# Altium project MOTHERBOARD.PrjPcb
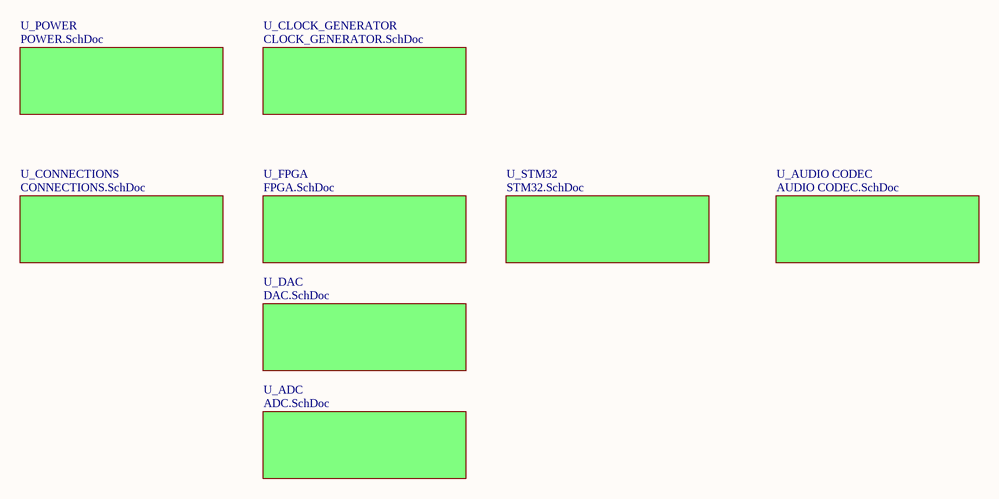
[diagram p0: MOTHERBOARD.SCHDOC]
9 sheets, 287 parts. Net scope: global (net labels, ports and power ports of the same name join across sheets).
Board file: MOTHERBOARD.PcbDoc
Sheets:
  MOTHERBOARD.SCHDOC
    U_ADC = ADC.SchDoc
    U_AUDIO CODEC = AUDIO CODEC.SchDoc
    U_DAC = DAC.SchDoc
    U_FPGA = FPGA.SchDoc
    U_POWER = POWER.SchDoc
    U_STM32 = STM32.SchDoc
    U_CLOCK_GENERATOR = CLOCK_GENERATOR.SchDoc
    U_CONNECTIONS = CONNECTIONS.SchDoc

## Sheet MOTHERBOARD.SCHDOC: MOTHERBOARD
size A4; DocumentNumber: 2; Revision: 2.0; SheetNumber: 2; SheetTotal: 18

### Sub-sheets
U_ADC = ADC.SchDoc: no entries
U_AUDIO CODEC = AUDIO CODEC.SchDoc: no entries
U_CLOCK_GENERATOR = CLOCK_GENERATOR.SchDoc: no entries
U_CONNECTIONS = CONNECTIONS.SchDoc: no entries
U_DAC = DAC.SchDoc: no entries
U_FPGA = FPGA.SchDoc: no entries
U_POWER = POWER.SchDoc: no entries
U_STM32 = STM32.SchDoc: no entries

### Notes on the sheet
- Title
- Size:
- Date:
- A4
- Number:
- Time:
- Revision:
- Sheet
- of
- File:

## Sheet ADC.SchDoc: ADC
size A4; DocumentNumber: 3; Revision: 2.0; SheetNumber: 3; SheetTotal: 18
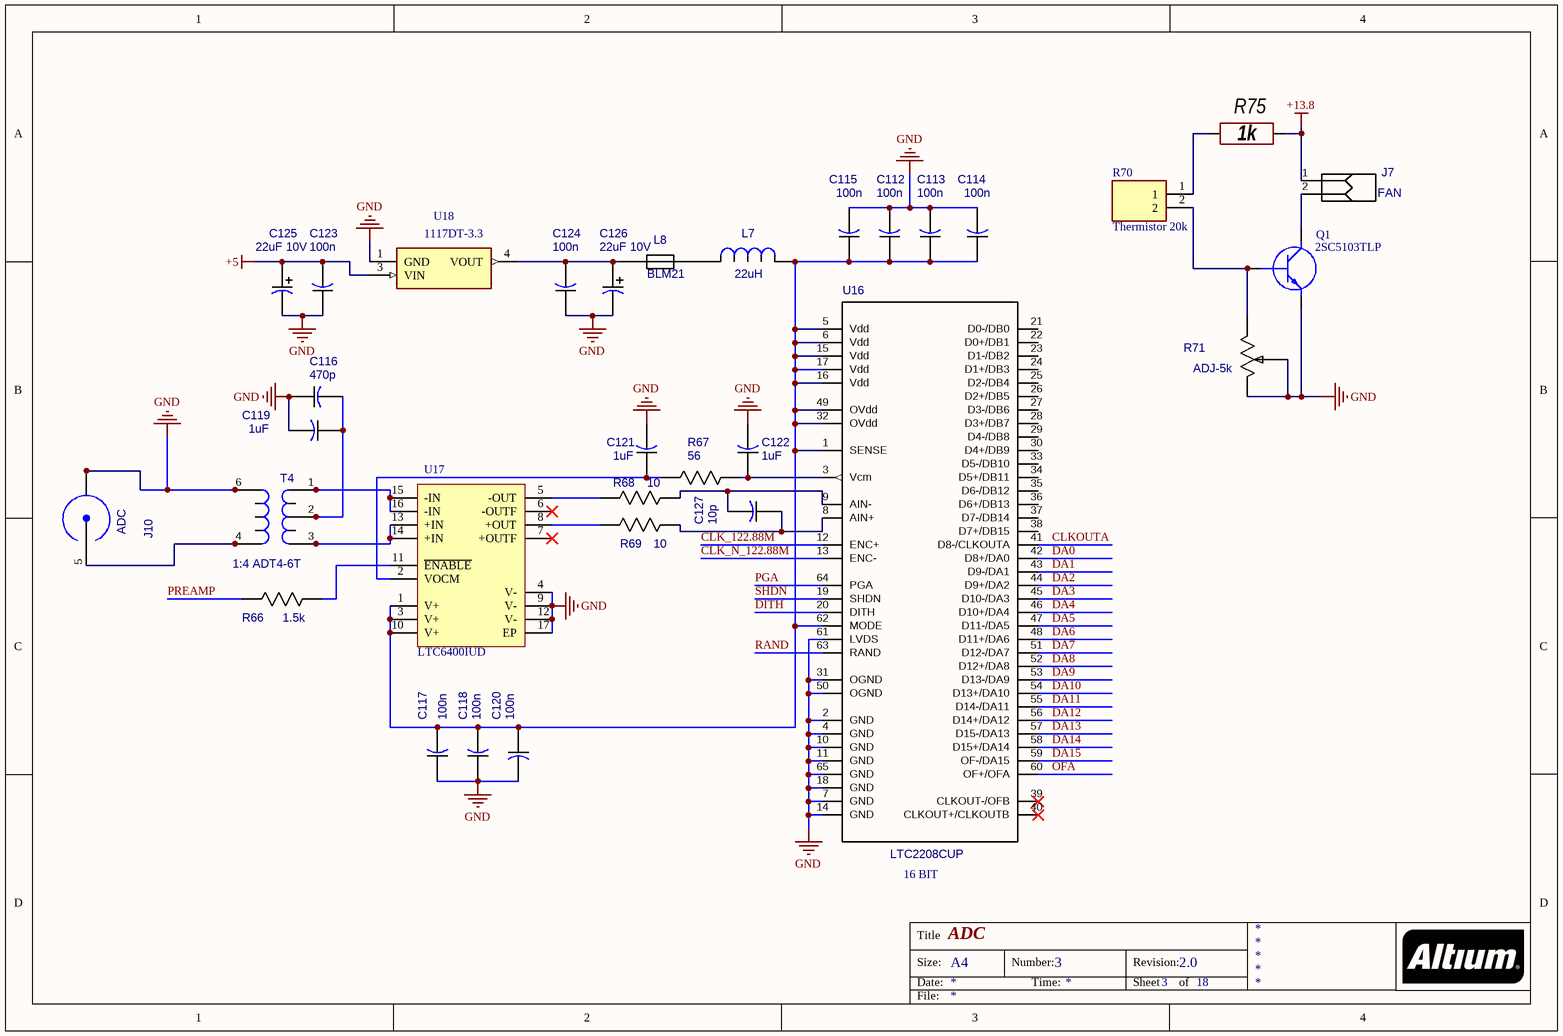
[diagram p1: ADC.SchDoc]

### Parts
C112  100n  [CAP_0805]
C113  100n  [CAP_0805]
C114  100n  [CAP_0805]
C115  100n  [CAP_0805]
C116  470p  [CAP_0805]
C117  100n  [CAP_0805]
C118  100n  [CAP_0805]
C119  1uF  [CAP_0805]
C120  100n  [CAP_0805]
C121  1uF  [CAP_0805]
C122  1uF  [CAP_0805]
C123  100n  [CAP_0805]
C124  100n  [CAP_0805]
C125  22uF 10V  [CAPAE_4.3x4.3h5.4]
C126  22uF 10V  [CAPAE_4.3x4.3h5.4]
C127  10p  [CAP_0805]
J7  FAN  [51022-0200]
J10  ADC  [31-5431]
L7  22uH  [IND_7x7]
L8  BLM21  [CAP_0805]
Q1  2SC5103TLP  [2SC5103TLQ]
R66  1.5k  [RES_0805]
R67  56  [RES_0805]
R68  10  [RES_0603]
R69  10  [RES_0603]
R70  Thermistor 20k  [MF52A103F3950A1]
R71  ADJ-5k  [306J]
R75  1k  [CH0805R]
T4  1:4 ADT4-6T  [TRANSF_ACORE2]
U16  LTC2208CUP  [LTC2208CUP]
U17  LTC6400IUD  [LT-UD-16_N]
U18  1117DT-3.3  [TO228P991X238-3N]

### Nets
+5: C123.2 C125.1(PLUS) U18.3(VIN)
+13.8: J7.1 R75.2
CLK_122.88M: U16.12(ENC+)
CLK_N_122.88M: U16.13(ENC-)
GND: C112.2 C113.2 C114.2 C115.2 C116.1 C117.1 C118.1 C119.2 C120.2 C121.2 C122.2 C123.1 C124.1 C125.2(MINUS) C126.2(MINUS) J10.1(GND) J10.2(GND) J10.3(GND) J10.4(GND) Q1.3(E) R71.1(CCW) R71.2(W) T4.6(P2) T4.10 U16.2(GND) U16.4(GND) U16.7(GND) U16.10(GND) U16.11(GND) U16.14(GND) U16.18(GND) U16.31(OGND) U16.50(OGND) U16.61(LVDS) U16.65(GND) U17.4(V-) U17.9(V-) U17.12(V-) U17.17(EP) U18.1(GND)
CLKOUTA: U16.41(D8-/CLKOUTA)
DA0: U16.42(D8+/DA0)
DA1: U16.43(D9-/DA1)
DA2: U16.44(D9+/DA2)
DA3: U16.45(D10-/DA3)
DA4: U16.46(D10+/DA4)
DA5: U16.47(D11-/DA5)
DA6: U16.48(D11+/DA6)
DA7: U16.51(D12-/DA7)
DA8: U16.52(D12+/DA8)
DA9: U16.53(D13-/DA9)
DA10: U16.54(D13+/DA10)
DA11: U16.55(D14-/DA11)
DA12: U16.56(D14+/DA12)
DA13: U16.57(D15-/DA13)
DA14: U16.58(D15+/DA14)
DA15: U16.59(OF-/DA15)
DITH: U16.20(DITH)
OFA: U16.60(OF+/OFA)
PGA: U16.64(PGA)
PREAMP: R66.2
RAND: U16.63(RAND)
SHDN: U16.19(SHDN)
NetC112_1: C112.1 C113.1 C114.1 C115.1 C117.2 C118.2 C120.1 L7.2 U16.1(SENSE) U16.5(Vdd) U16.6(Vdd) U16.15(Vdd) U16.16(Vdd) U16.17(Vdd) U16.32(OVdd) U16.49(OVdd) U16.62(MODE) U17.1(V+) U17.3(V+) U17.10(V+)
NetC116_2: C116.2 C119.1 T4.2(S2) T4.8
NetC121_1: C121.1 R67.1 U17.2(VOCM)
NetC122_1: C122.1 R67.2 U16.3(Vcm)
NetC124_2: C124.2 C126.1(PLUS) L8.1 U18.4(VOUT)
NetC127_1: C127.1 R69.2 U16.8(AIN+)
NetC127_2: C127.2 R68.2 U16.9(AIN-)
NetJ7_2: J7.2 Q1.2(C)
NetJ10_5: J10.5(CON) T4.4(P1) T4.11
NetL7_1: L7.1 L8.2
NetQ1_1: Q1.1(B) R70.2 R71.3(CW)
NetR66_1: R66.1 U17.11(~{ENABLE})
NetR68_1: R68.1 U17.5(-OUT)
NetR69_1: R69.1 U17.8(+OUT)
NetR70_1: R70.1 R75.1
NetT4_1: T4.1(S3) T4.7 U17.15(-IN) U17.16(-IN)
NetT4_3: T4.3(S1) T4.9 U17.13(+IN) U17.14(+IN)

Not connected (* = marked no-connect by the designer): U16 21(D0-/DB0) 22(D0+/DB1) 23(D1-/DB2) 24(D1+/DB3) 25(D2-/DB4) 26(D2+/DB5) 27(D3-/DB6) 28(D3+/DB7) 29(D4-/DB8) 30(D4+/DB9) 33(D5-/DB10) 34(D5+/DB11) 35(D6-/DB12) 36(D6+/DB13) 37(D7-/DB14) 38(D7+/DB15) 39(CLKOUT-/OFB)* 40(CLKOUT+/CLKOUTB)*; U17 6(-OUTF)* 7(+OUTF)*

### Notes on the sheet
- 16 BIT
- Title
- Size:
- Date:
- A4
- Number:
- Time:
- Revision:
- Sheet
- of
- File:

### Library data of the parts
C112-C124 C127 = CAP_0805
  C112-C115 C117 C118 C120 C123 C124: Value: 100n
  C116: Value: 470p
  C119 C121 C122: Value: 1uF
  C127: Value: 10p
C125 C126 = CAPAE_4.3x4.3h5.4
  C125: Value: *
  C126: Value: 22uF 10V
J7 = 51022-0200
J10 = 31-5431: SMA; Value: ADC
L7 = IND_1206
L8 = IND_FERRITE_BEAD
Q1 = 2SC5103TLP: Transistor BJT NPN; Manufacturer_Name: ROHM Semiconductor; Datasheet Link: https://componentsearchengine.com/Datasheets/1/2SC5103TLP.pdf; Height: 2.5mm; Manufacturer_Part_Number: 2SC5103TLP; Mouser Part Number: 755-2SC5103TLP; Mouser Price/Stock: https://www.mouser.co.uk/ProductDetail/ROHM-Semiconductor/2SC5103TLP?qs=4kLU8WoGk0sDL0zMTtaqxg%3D%3D
R66 R67 = RES_0805
  R66: Value: 1.5k
  R67: Value: 56
R68 R69 = RES_0603: Value: 10
R70 = MF52A103F3950_A1_: Thermistor; Manufacturer_Name: Nanjing Shiheng Electronic Technology Co.; Manufacturer_Part_Number: MF52A103F3950(A1); Datasheet Link: https://datasheet.lcsc.com/szlcsc/Nanjing-Shiheng-Elec-MF52A1103F3950-P334-4_C13879.pdf; Height: 4mm
R71 = 306J
R75 = Resistor: Manufacturer: *; Model: *; HelpURL: *; ComponentKind: *; Value: *
T4 = TRANSF_ACORE2: Transformer; Value: 1:4 ADT4-6T
U17 = CMP-0359-03855-2: Single Channel, Low Noise, Low Distortion Differential ADC Driver for 300 MHz IF, 1800 MHz Typical GBW, 4500 V/us Typical SR, 2.85 to 3.5 V, 16-Pin QFN (UD-16), Industrial, Pb-Free; Manufacturer: Linear Technology; Linear Technology Part Number: LTC6400-20; PartNumber: LTC6400IUD-20#PBF; Vs Min (V): 2.85; SR (V/us) Typical: 4500; Is (mA) Typical: 90; Vs Max (V): 3.5; Vos (mV) Typical: 2; GBW (MHz) Typical: 1800; Channels (#): 1; RoHS: Pb-Free; PackageReference: LT-UD-16; Type: DIFF; ComponentLink3Description: Package Specification; PackageDescription: 16-Lead Plastic QFN, Body 3.00 x 3.00 mm, Pitch 0.5 mm; ComponentLink1URL: http://www.linear.com/; Mounting Technology: Surface Mount; ComponentLink2URL: http://cds.linear.com/docs/en/datasheet/640020f.pdf; Code_JEDEC: MO-220; ComponentLink3URL: http://cds.linear.com/docs/en/packaging/QFN_16_05-08-1691.pdf; ComponentLink2Description: Datasheet; ComponentLink1Description: Manufacturer URL; RevisionNote: URLs updated
U18 = LM1117DT-ADJ: LD1117DT-2.5 DPAK; Manufacturer_Name: Texas Instruments; Datasheet Link: http://www.ti.com/lit/ds/symlink/lm1117-n.pdf; Height: 2.38mm; Manufacturer_Part_Number: LM1117DT-ADJ; Mouser Part Number: 926-LM1117DT-ADJ; Mouser Price/Stock: https://www.mouser.com/Search/Refine.aspx?Keyword=926-LM1117DT-ADJ
U16 = LTC2208CUP: Value: LTC2208CUP

## Sheet AUDIO CODEC.SchDoc: AUDIO CODEC
size A4; DocumentNumber: 5; Revision: 2.0; SheetNumber: 5; SheetTotal: 18
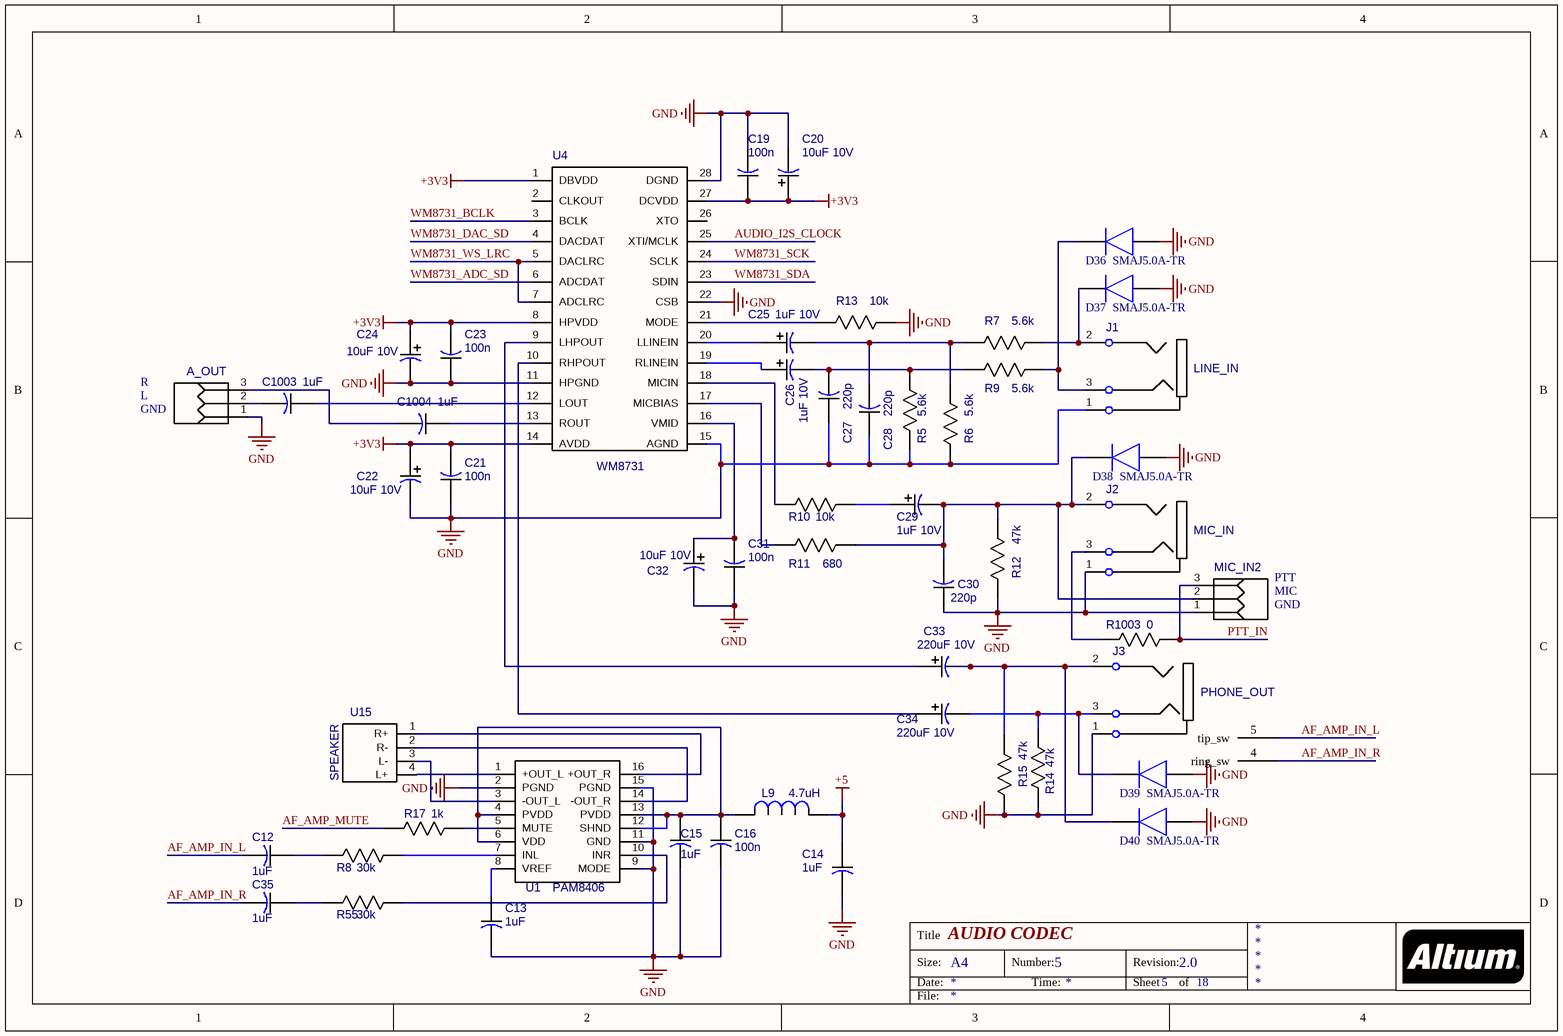
[diagram p2: AUDIO CODEC.SchDoc]

### Parts
A_OUT  51022-0300_1  [51022-0200 - duplicate]  (value not drawn)
C12  1uF  [CAP_0805]
C13  1uF  [CAP_0805]
C14  1uF  [CAP_0805]
C15  1uF  [CAP_0805]
C16  100n  [CAP_0805]
C19  100n  [CAP_0805]
C20  10uF 10V  [CAPAE_4.3x4.3h5.4]
C21  100n  [CAP_0805]
C22  10uF 10V  [CAPAE_4.3x4.3h5.4]
C23  100n  [CAP_0805]
C24  10uF 10V  [CAPAE_4.3x4.3h5.4]
C25  1uF 10V  [CAPAE_4.3x4.3h5.4]
C26  1uF 10V  [CAPAE_4.3x4.3h5.4]
C27  220p  [CAP_0805]
C28  220p  [CAP_0805]
C29  1uF 10V  [CAPAE_4.3x4.3h5.4]
C30  220p  [CAP_0805]
C31  100n  [CAP_0805]
C32  10uF 10V  [CAPAE_4.3x4.3h5.4]
C33  220uF 10V  [EEEFC_sizeС]
C34  220uF 10V  [EEEFC_sizeС]
C35  1uF  [CAP_0805]
C1003  1uF  [CAP_0805]
C1004  1uF  [CAP_0805]
D36  SMAJ5.0A-TR  [SMBJ36CATR]
D37  SMAJ5.0A-TR  [SMBJ36CATR]
D38  SMAJ5.0A-TR  [SMBJ36CATR]
D39  SMAJ5.0A-TR  [SMBJ36CATR]
D40  SMAJ5.0A-TR  [SMBJ36CATR]
J1  value LINE_IN  [SJ1-3525NG]  (hidden comment: SJ1-3525NG)
J2  value MIC_IN  [SJ1-3525NG]  (hidden comment: SJ1-3525NG)
J3  value PHONE_OUT  [SJ1-3525NG]  (hidden comment: SJ1-3525NG)
L9  value 4.7uH  [IND_1812]  (hidden comment: 3.3uH)
MIC_IN2  51022-0300_1  [51022-0200 - duplicate]  (value not drawn)
R5  5.6k  [RES_0805]
R6  5.6k  [RES_0805]
R7  5.6k  [RES_0805]
R8  30k  [RES_0805]
R9  5.6k  [RES_0805]
R10  10k  [RES_0805]
R11  680  [RES_0805]
R12  47k  [RES_0805]
R13  10k  [RES_0805]
R14  47k  [RES_0805]
R15  47k  [RES_0805]
R17  1k  [RES_0805]
R55  30k  [RES_0805]
R1003  0  [RES_0805]
U1  PAM8406  [PAM8403]
U4  WM8731  [WM8731]
U15  SPEAKER  [speaker conn]

### Nets
+3V3: C19.1 C20.1(PLUS) C21.2 C22.1(PLUS) C23.2 C24.1(PLUS) U4.1(DBVDD) U4.8(HPVDD) U4.14(AVDD) U4.27(DCVDD)
+5: C14.1 L9.2
GND: A_OUT.1 C13.2 C14.2 C15.2 C16.2 C19.2 C20.2(MINUS) C21.1 C22.2(MINUS) C23.1 C24.2(MINUS) C27.1 C28.1 C30.1 C31.1 C32.2(MINUS) D36.2(A) D37.2(A) D38.2(A) D39.2(A) D40.2(A) J1.1(sleeve) J2.1(sleeve) J3.1(sleeve) MIC_IN2.1 R5.1 R6.1 R12.1 R13.1 R14.1 R15.1 U1.2(PGND) U1.9(MODE) U1.11(GND) U1.15(PGND) U4.11(HPGND) U4.15(AGND) U4.22(CSB) U4.28(DGND)
AF_AMP_IN_L: C12.2 J3.5(tip_sw)
AF_AMP_IN_R: C35.2 J3.4(ring_sw)
AF_AMP_MUTE: R17.2
AUDIO_I2S_CLOCK: U4.25(XTI/MCLK)
PTT_IN: MIC_IN2.3 R1003.2
WM8731_ADC_SD: U4.6(ADCDAT)
WM8731_BCLK: U4.3(BCLK)
WM8731_DAC_SD: U4.4(DACDAT)
WM8731_SCK: U4.24(SCLK)
WM8731_SDA: U4.23(SDIN)
WM8731_WS_LRC: U4.5(DACLRC) U4.7(ADCLRC)
NetA_OUT_2: A_OUT.2 C1003.2
NetA_OUT_3: A_OUT.3 C1004.2
NetC12_1: C12.1 R8.2
NetC13_1: C13.1 U1.8(VREF)
NetC15_1: C15.1 C16.1 L9.1 U1.4(PVDD) U1.6(VDD) U1.12(SHND) U1.13(PVDD)
NetC25_1: C25.1(PLUS) U4.20(LLINEIN)
NetC25_2: C25.2(MINUS) C28.2 R6.2 R7.2
NetC26_1: C26.1(PLUS) U4.19(RLINEIN)
NetC26_2: C26.2(MINUS) C27.2 R5.2 R9.2
NetC29_1: C29.1(PLUS) R10.1
NetC29_2: C29.2(MINUS) C30.2 D38.1(K) J2.2(tip) MIC_IN2.2 R11.1 R12.2
NetC31_2: C31.2 C32.1(PLUS) U4.16(VMID)
NetC33_1: C33.1(PLUS) U4.9(LHPOUT)
NetC33_2: C33.2(MINUS) D40.1(K) J3.2(tip) R15.2
NetC34_1: C34.1(PLUS) U4.10(RHPOUT)
NetC34_2: C34.2(MINUS) D39.1(K) J3.3(ring) R14.2
NetC35_1: C35.1 R55.2
NetC1003_1: C1003.1 U4.12(LOUT)
NetC1004_1: C1004.1 U4.13(ROUT)
NetD36_1: D36.1(K) J1.3(ring) R9.1
NetD37_1: D37.1(K) J1.2(tip) R7.1
NetJ2_3: J2.3(ring) R1003.1
NetR8_1: R8.1 U1.7(INL)
NetR10_2: R10.2 U4.18(MICIN)
NetR11_2: R11.2 U4.17(MICBIAS)
NetR13_2: R13.2 U4.21(MODE)
NetR17_1: R17.1 U1.5(MUTE)
NetR55_1: R55.1 U1.10(INR)
NetU1_1: U1.1(+OUT_L) U15.4(L+)
NetU1_3: U1.3(-OUT_L) U15.3(L-)
NetU1_14: U1.14(-OUT_R) U15.2(R-)
NetU1_16: U1.16(+OUT_R) U15.1(R+)

Not connected (* = marked no-connect by the designer): U4 2(CLKOUT) 26(XTO)

### Notes on the sheet
- R
- L
- GND
- PTT
- MIC
- Title
- Size:
- Date:
- A4
- Number:
- Time:
- Revision:
- Sheet
- of
- File:

### Library data of the parts
A_OUT MIC_IN2 = 51022-0300_1: 51022-0300; Value: *
C12-C16 C19 C21 C23 C27 C28 C30 C31 C35 C1003 C1004 = CAP_0805
  C12 C14 C15 C35 C1003 C1004: Value: 1uF
  C16 C19 C21 C23 C31: Value: 100n
  C27 C28 C30: Value: 220p
C20 C22 C24-C26 C29 C32-C34 = CAPAE_4.3x4.3h5.4
  C20 C22 C24 C32: Value: 10uF 10V
  C25 C26 C29: Value: 1uF 10V
  C33 C34: Value: 220uF 10V
D36-D40 = SMLVT3V3: Diode; Manufacturer_Name: STMicroelectronics; Allied_Number: 70013736; Datasheet Link: http://www.st.com/web/en/resource/technical/document/datasheet/CD00000923.pdf; Height: 2.65mm; Manufacturer_Part_Number: SMLVT3V3; Mouser Part Number: 511-SMLVT3V3; Mouser Price/Stock: https://www.mouser.com/Search/Refine.aspx?Keyword=511-SMLVT3V3; RS Part Number: 5444821P; RS Price/Stock: http://uk.rs-online.com/web/p/products/5444821P; Allied Price/Stock: http://www.alliedelec.com/stmicroelectronics-smlvt3v3/70013736/
J1-J3 = SJ1-3523N
L9 = IND_1812
R5-R15 R17 R55 R1003 = RES_0805
  R5-R7 R9: Value: 5.6k
  R10 R13: Value: 10k
  R11: Value: 680
  R12 R14 R15: Value: 47k
U15 = speaker conn: 4 pins conn; Value: *
U4 = WM8731: Value: WM8731

## Sheet DAC.SchDoc: DAC
size A4; DocumentNumber: 8; Revision: 2.0; SheetNumber: 8; SheetTotal: 18
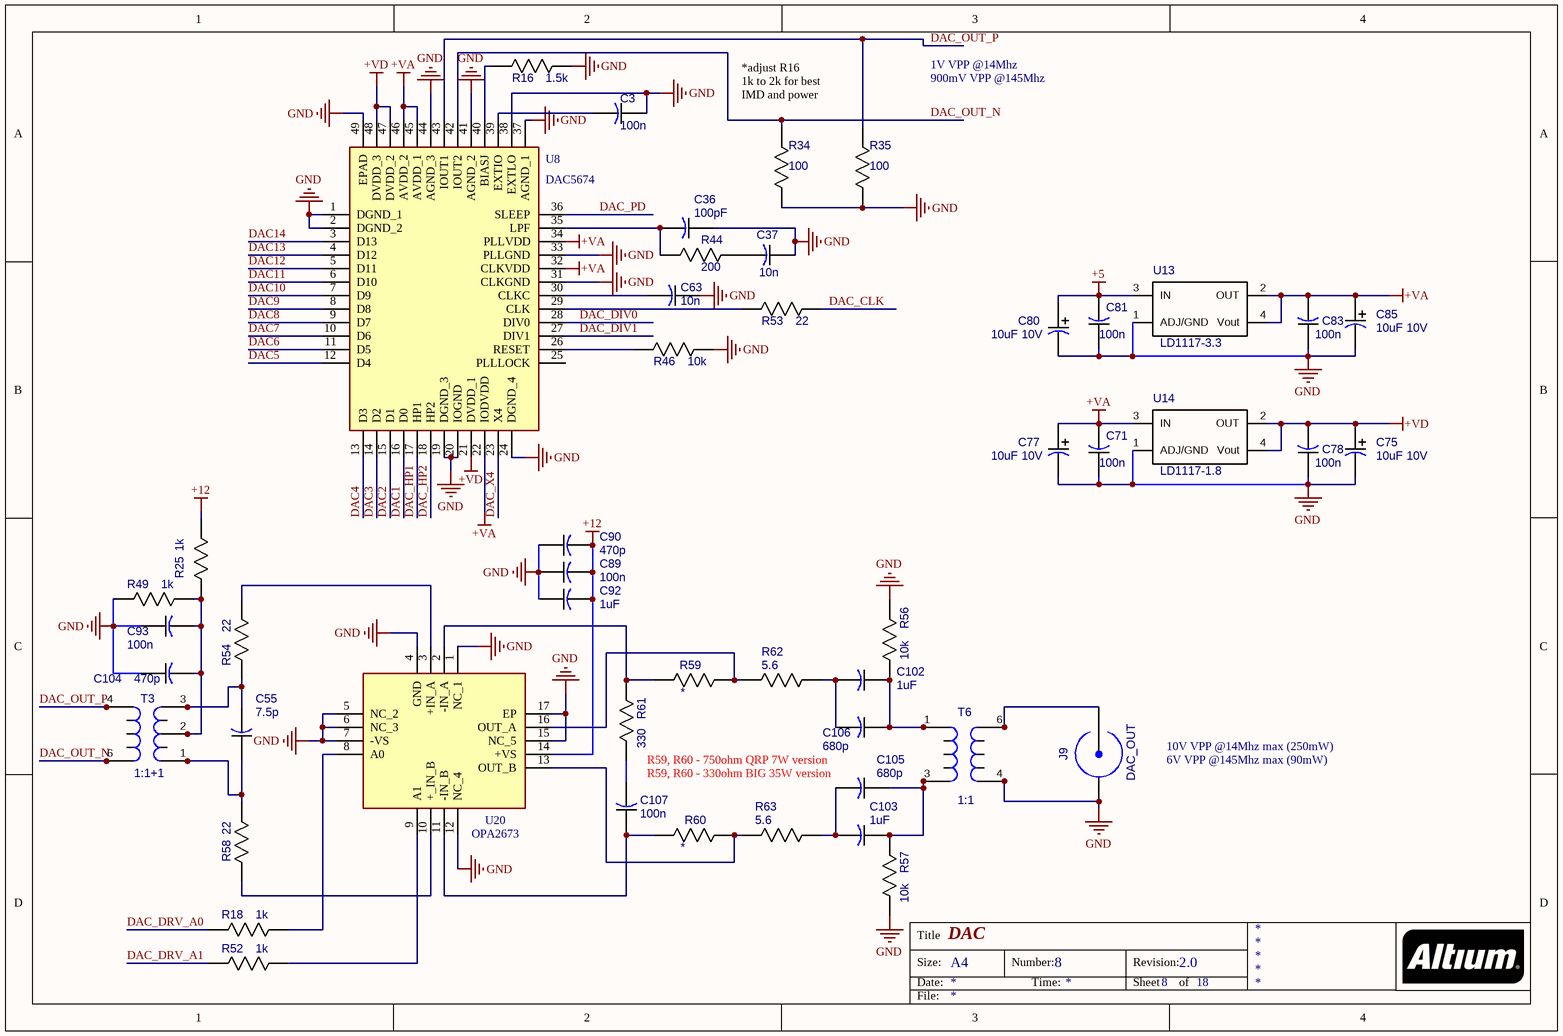
[diagram p3: DAC.SchDoc]

### Parts
C3  100n  [CAP_0805]
C36  100pF  [CAP_0805]
C37  10n  [CAP_0805]
C55  7.5p  [CAP_0805]
C63  10n  [CAP_0805]
C71  100n  [CAP_0805]
C75  10uF 10V  [CAPAE_4.3x4.3h5.4]
C77  10uF 10V  [CAPAE_4.3x4.3h5.4]
C78  100n  [CAP_0805]
C80  10uF 10V  [CAPAE_4.3x4.3h5.4]
C81  100n  [CAP_0805]
C83  100n  [CAP_0805]
C85  10uF 10V  [CAPAE_4.3x4.3h5.4]
C89  100n  [CAP_0805]
C90  470p  [CAP_0805]
C92  1uF  [CAP_0805]
C93  100n  [CAP_0805]
C102  1uF  [CAP_1206]
C103  1uF  [CAP_1206]
C104  470p  [CAP_0805]
C105  680p  [CAP_1206]
C106  680p  [CAP_1206]
C107  100n  [CAP_0805]
J9  DAC_OUT  [31-5431]
R16  1.5k  [RES_0805]
R18  1k  [RES_0805]
R25  1k  [RES_0805]
R34  100  [RES_0805]
R35  100  [RES_0805]
R44  200  [RES_0805]
R46  10k  [RES_0805]
R49  1k  [RES_0805]
R52  1k  [RES_0805]
R53  22  [RES_0805]
R54  22  [RES_0805]
R56  10k  [RES_0805]
R57  10k  [RES_0805]
R58  22  [RES_0805]
R59  *  [RES_0805]
R60  *  [RES_0805]
R61  330  [RES_0805]
R62  5.6  [RES_1206]
R63  5.6  [RES_1206]
T3  1:1+1  [TRANSF_ACORE2]
T6  1:1  [TRANSF_ACORE]
U8  DAC5674  [QFP50P900X900X100-49N]
U13  value LD1117-3.3  [LT1117CST-3.3]  (hidden comment: 1117-3.3)
U14  value LD1117-1.8  [LT1117CST-3.3]  (hidden comment: 1117-1.8)
U20  OPA2673  [QFN65P400X400X100-17N-D]

### Nets
+5: C80.1(PLUS) C81.2 U13.3(IN)
+12: C89.2 C90.2 C92.2 R25.2 U20.14(+VS)
+VA: C71.2 C77.1(PLUS) C83.2 C85.1(PLUS) U8.22(IODVDD) U8.32(CLKVDD) U8.34(PLLVDD) U8.45(AVDD_1) U8.46(AVDD_2) U13.2(OUT) U13.4(Vout) U14.3(IN)
+VD: C75.1(PLUS) C78.2 U8.21(DVDD_1) U8.47(DVDD_2) U8.48(DVDD_3) U14.2(OUT) U14.4(Vout)
GND: C3.1 C36.1 C37.1 C63.1 C71.1 C75.2(MINUS) C77.2(MINUS) C78.1 C80.2(MINUS) C81.1 C83.1 C85.2(MINUS) C89.1 C90.1 C92.1 C93.1 C104.1 J9.1(GND) J9.2(GND) J9.3(GND) J9.4(GND) R16.1 R34.1 R35.1 R46.1 R49.2 R56.1 R57.2 T6.4(S2) T6.11 U8.1(DGND_1) U8.2(DGND_2) U8.19(DGND_3) U8.20(IOGND) U8.24(DGND_4) U8.31(CLKGND) U8.33(PLLGND) U8.37(AGND_1) U8.38(EXTLO) U8.41(AGND_2) U8.44(AGND_3) U8.49(EPAD) U13.1(ADJ/GND) U14.1(ADJ/GND) U20.1(NC_1) U20.4(GND) U20.5(NC_2) U20.6(NC_3) U20.7(-VS) U20.12(NC_4) U20.15(NC_5) U20.17(EP)
DAC1: U8.16(D0)
DAC2: U8.15(D1)
DAC3: U8.14(D2)
DAC4: U8.13(D3)
DAC5: U8.12(D4)
DAC6: U8.11(D5)
DAC7: U8.10(D6)
DAC8: U8.9(D7)
DAC9: U8.8(D8)
DAC10: U8.7(D9)
DAC11: U8.6(D10)
DAC12: U8.5(D11)
DAC13: U8.4(D12)
DAC14: U8.3(D13)
DAC_CLK: R53.1
DAC_DIV0: U8.28(DIV0)
DAC_DIV1: U8.27(DIV1)
DAC_DRV_A0: R18.1
DAC_DRV_A1: R52.1
DAC_HP1: U8.17(HP1)
DAC_HP2: U8.18(HP2)
DAC_OUT_N: R34.2 T3.6(P2) T3.10 U8.42(IOUT2)
DAC_OUT_P: R35.2 T3.4(P1) T3.11 U8.43(IOUT1)
DAC_PD: U8.36(SLEEP)
DAC_X4: U8.23(X4)
NetC3_2: C3.2 U8.39(EXTIO)
NetC36_2: C36.2 R44.2 U8.35(LPF)
NetC37_2: C37.2 R44.1
NetC55_1: C55.1 R58.2 T3.1(S3) T3.7
NetC55_2: C55.2 R54.1 T3.3(S1) T3.9
NetC63_2: C63.2 U8.30(CLKC)
NetC93_2: C93.2 C104.2 R25.1 R49.1 T3.2(S2) T3.8
NetC102_1: C102.1 C106.1 R56.2 T6.1(P1) T6.7
NetC102_2: C102.2 C106.2 R62.1
NetC103_1: C103.1 C105.1 R57.1 T6.3(P2) T6.9
NetC103_2: C103.2 C105.2 R63.1
NetC107_1: C107.1 R60.2 U20.11(-IN_B)
NetC107_2: C107.2 R61.2
NetJ9_5: J9.5(CON) T6.6(S1) T6.10
NetR16_2: R16.2 U8.40(BIASJ)
NetR18_2: R18.2 U20.8(A0)
NetR46_2: R46.2 U8.26(RESET)
NetR52_2: R52.2 U20.9(A1)
NetR53_2: R53.2 U8.29(CLK)
NetR54_2: R54.2 U20.3(+IN_A)
NetR58_1: R58.1 U20.10(+_IN_B)
NetR59_1: R59.1 R62.2 U20.16(OUT_A)
NetR59_2: R59.2 R61.1 U20.2(-IN_A)
NetR60_1: R60.1 R63.2 U20.13(OUT_B)

Not connected (* = marked no-connect by the designer): T6 8(0); U8 25(PLLLOCK)

### Notes on the sheet
- *adjust R16
  1k to 2k for best IMD and power
- 1V VPP @14Mhz
- 900mV VPP @145Mhz
- R59, R60 - 750ohm QRP 7W version
- (near C105) R59, R60 - 330ohm BIG 35W version
- 10V VPP @14Mhz max (250mW)
- 6V VPP @145Mhz max (90mW)
- Title
- Size:
- Date:
- A4
- Number:
- Time:
- Revision:
- Sheet
- of
- File:

### Library data of the parts
C3 C36 C37 C55 C63 C71 C78 C81 C83 C89 C90 C92 C93 C104 C107 = CAP_0805
  C71 C78 C81 C83 C89 C93 C107: Value: 100n
  C90 C104: Value: 470p
  C92: Value: 1uF
C75 C77 C80 C85 = CAPAE_4.3x4.3h5.4: Value: 10uF 10V
C102 C103 C105 C106 = CAP_1206
  C102 C103: Value: 1uF
  C105 C106: Value: 680p
J9 = 31-5431: SMA; Value: DAC_OUT
R16 R18 R25 R34 R35 R44 R46 R49 R52-R54 R56-R61 = RES_0805
  R25 R49: Value: 1k
  R54 R58: Value: 22
  R56 R57: Value: 10k
  R61: Value: 330
R62 R63 = RES_1206: Value: 5.6
T3 = TRANSF_ACORE2: Transformer; Value: 1:1+1
T6 = TRANSF_ACORE: Transformer; Value: 1:1
U8 = DAC5674IPHP: Integrated Circuit; Manufacturer_Name: Texas Instruments; Datasheet Link: https://www.ti.com/lit/ds/symlink/dac5674.pdf; Height: 1mm; Manufacturer_Part_Number: DAC5674IPHP
U13 = LT1117CST-3.3
U14 = LT1117CST-3.3: LT1117CST-1.8
U20 = OPA2673IRGVT: Integrated Circuit; Manufacturer_Name: Texas Instruments; Datasheet Link: http://www.ti.com/lit/gpn/opa2673; Height: 1mm; Manufacturer_Part_Number: OPA2673IRGVT; Mouser Part Number: 595-OPA2673IRGVT; Mouser Price/Stock: https://www.mouser.co.uk/ProductDetail/Texas-Instruments/OPA2673IRGVT?qs=xHCJPbHdANbeLKV0FJjs6g%3D%3D; RS Part Number: 8122587P; RS Price/Stock: http://uk.rs-online.com/web/p/products/8122587P

## Sheet FPGA.SchDoc: FPGA
size A3; DocumentNumber: 9; Revision: 2.0; SheetNumber: 9; SheetTotal: 18
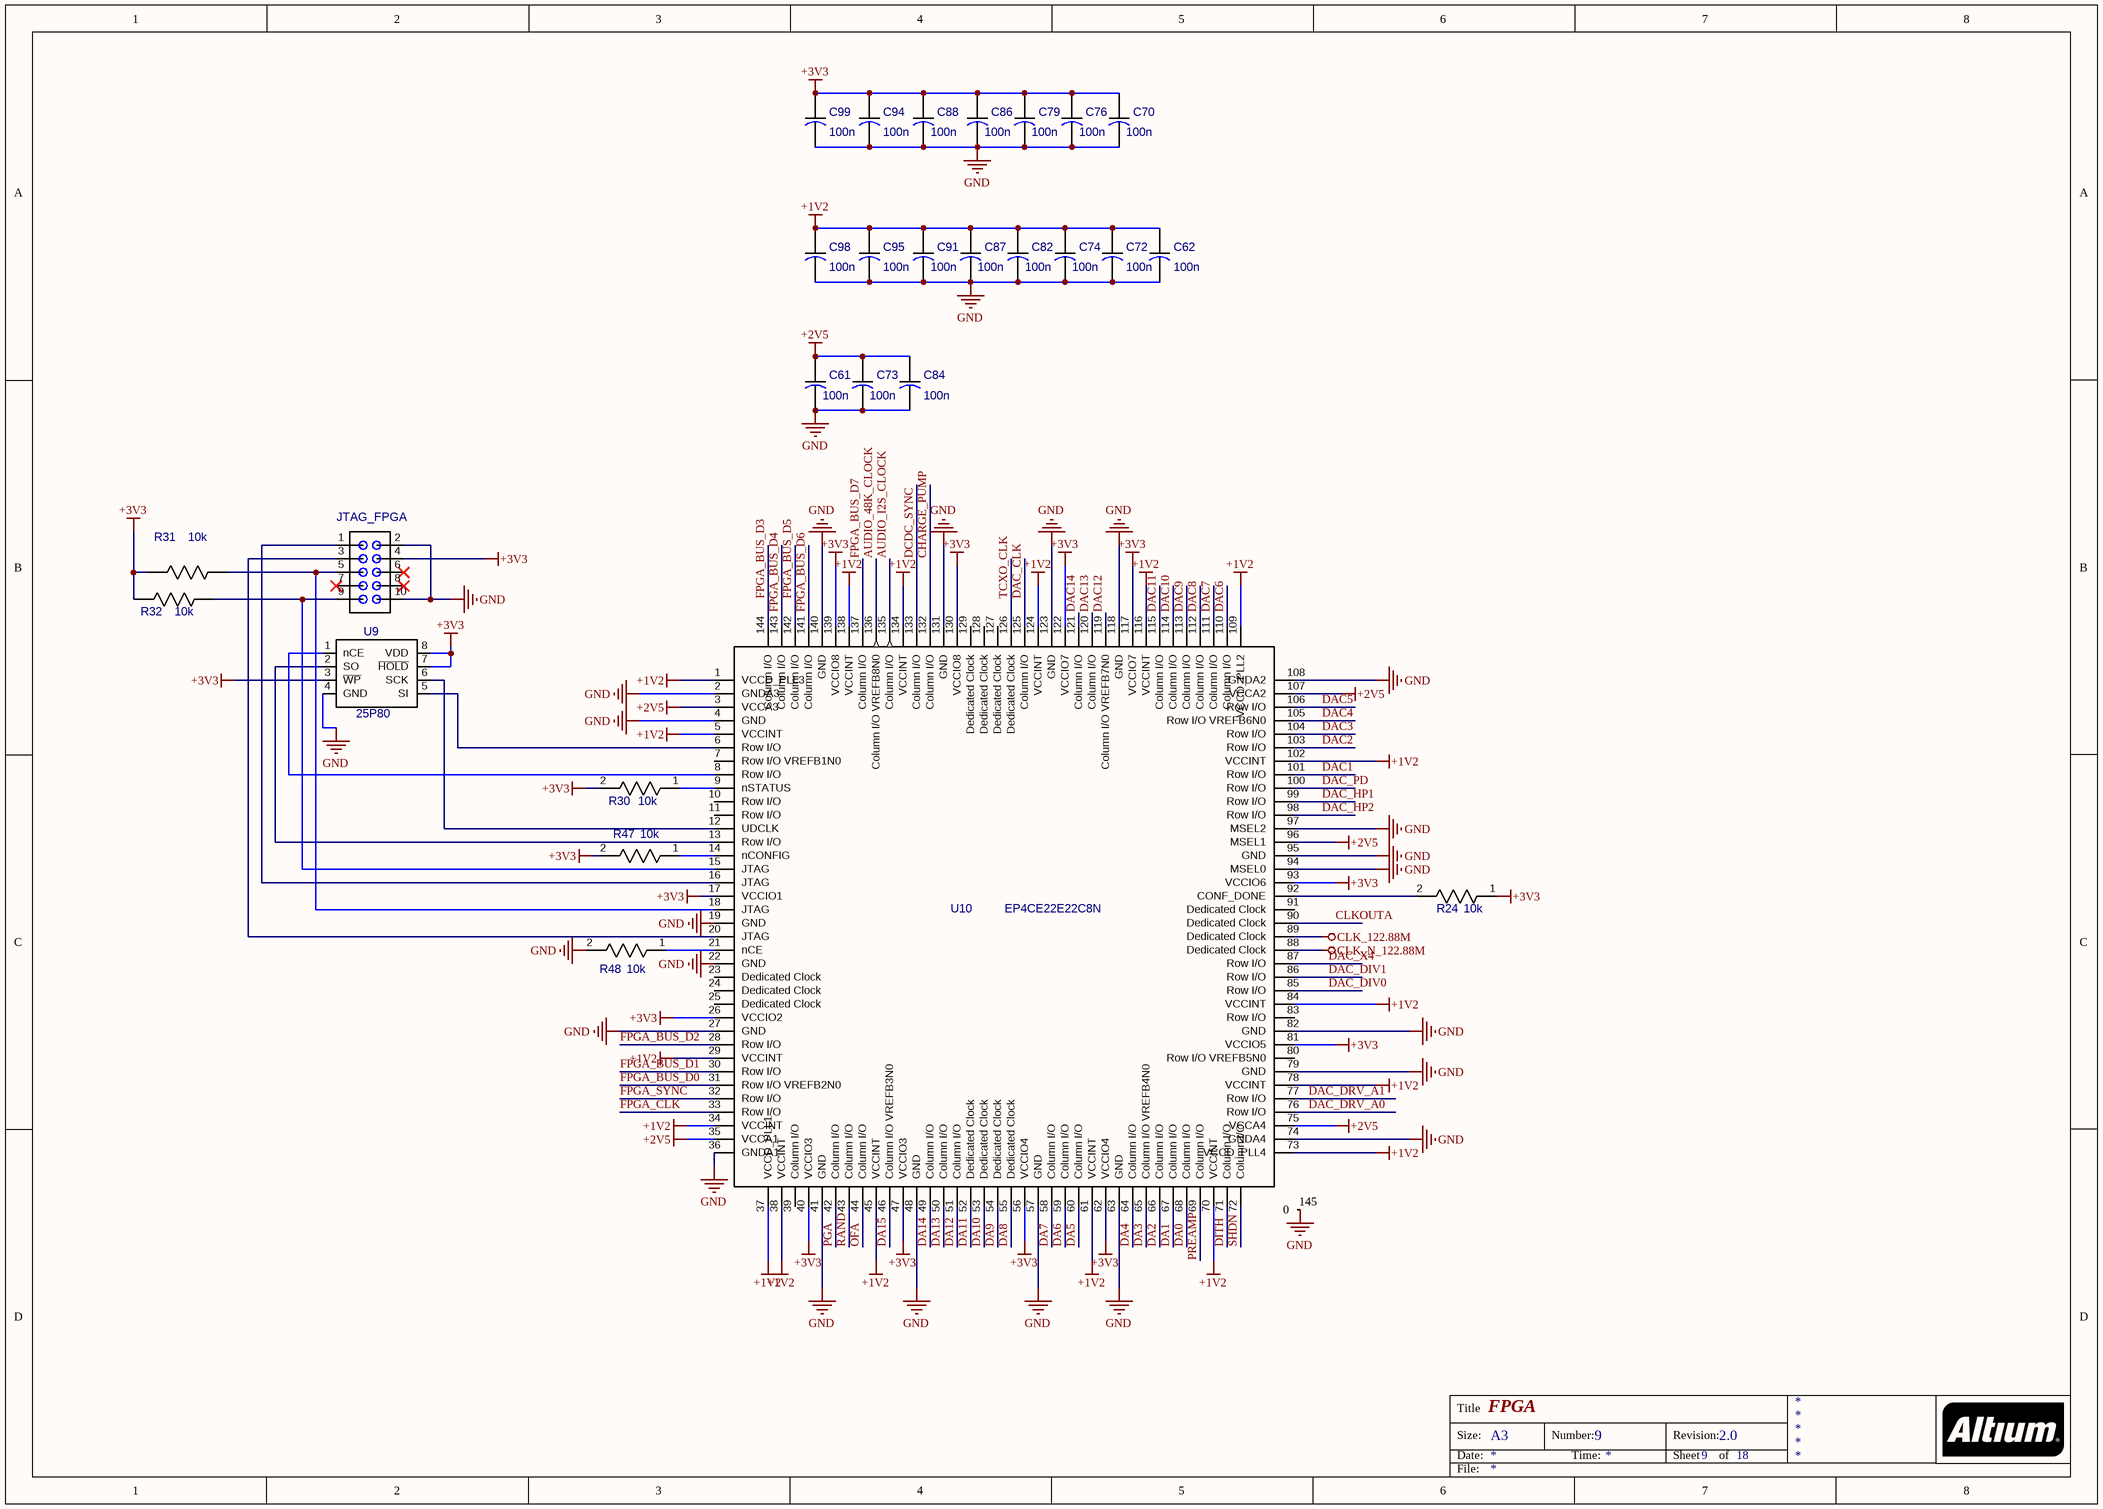
[diagram p4: FPGA.SchDoc]

### Parts
C61  100n  [CAP_0805]
C62  100n  [CAP_0805]
C70  100n  [CAP_0805]
C72  100n  [CAP_0805]
C73  100n  [CAP_0805]
C74  100n  [CAP_0805]
C76  100n  [CAP_0805]
C79  100n  [CAP_0805]
C82  100n  [CAP_0805]
C84  100n  [CAP_0805]
C86  100n  [CAP_0805]
C87  100n  [CAP_0805]
C88  100n  [CAP_0805]
C91  100n  [CAP_0805]
C94  100n  [CAP_0805]
C95  100n  [CAP_0805]
C98  100n  [CAP_0805]
C99  100n  [CAP_0805]
JTAG_FPGA  (no value)  [IDC10]
R24  10k  [RES_0805]
R30  10k  [RES_0805]
R31  10k  [RES_0805]
R32  10k  [RES_0805]
R47  10k  [RES_0805]
R48  10k  [RES_0805]
U9  25P80  [25P80]
U10  EP4CE22E22C8N  [QFP144-20-2222A]

### Nets
+1V2: C62.1 C72.1 C74.1 C82.1 C87.1 C91.1 C95.1 C98.1 U10.1(VCCD_PLL3) U10.5(VCCINT) U10.29(VCCINT) U10.34(VCCINT) U10.37(VCCD_PLL1) U10.38(VCCINT) U10.45(VCCINT) U10.61(VCCINT) U10.70(VCCINT) U10.73(VCCD_PLL4) U10.78(VCCINT) U10.84(VCCINT) U10.102(VCCINT) U10.109(VCCD_PLL2) U10.116(VCCINT) U10.124(VCCINT) U10.134(VCCINT) U10.138(VCCINT)
+2V5: C61.1 C73.1 C84.1 U10.3(VCCA3) U10.35(VCCA1) U10.75(VCCA4) U10.96(MSEL1) U10.107(VCCA2)
+3V3: C70.1 C76.1 C79.1 C86.1 C88.1 C94.1 C99.1 JTAG_FPGA.4 R24.1 R30.2 R31.2 R32.2 R47.2 U9.3(~{WP}) U9.7(~{HOLD}) U9.8(VDD) U10.17(VCCIO1) U10.26(VCCIO2) U10.40(VCCIO3) U10.47(VCCIO3) U10.56(VCCIO4) U10.62(VCCIO4) U10.81(VCCIO5) U10.93(VCCIO6) U10.117(VCCIO7) U10.122(VCCIO7) U10.130(VCCIO8) U10.139(VCCIO8)
CLK_122.88M: U10.89(Dedicated_Clock)
CLK_N_122.88M: U10.88(Dedicated_Clock)
GND: C61.2 C62.2 C70.2 C72.2 C73.2 C74.2 C76.2 C79.2 C82.2 C84.2 C86.2 C87.2 C88.2 C91.2 C94.2 C95.2 C98.2 C99.2 JTAG_FPGA.2 JTAG_FPGA.10 R48.2 U9.4(GND) U10.2(GNDA3) U10.4(GND) U10.19(GND) U10.22(GND) U10.27(GND) U10.36(GNDA1) U10.41(GND) U10.48(GND) U10.57(GND) U10.63(GND) U10.74(GNDA4) U10.79(GND) U10.82(GND) U10.94(MSEL0) U10.95(GND) U10.97(MSEL2) U10.108(GNDA2) U10.118(GND) U10.123(GND) U10.131(GND) U10.140(GND) U10.145(0)
AUDIO_48K_CLOCK: U10.136(Column_I/O_VREFB8N0)
AUDIO_I2S_CLOCK: U10.135(Column_I/O)
CHARGE_PUMP: U10.132(Column_I/O)
CLKOUTA: U10.90(Dedicated_Clock)
DA0: U10.68(Column_I/O)
DA1: U10.67(Column_I/O)
DA2: U10.66(Column_I/O)
DA3: U10.65(Column_I/O_VREFB4N0)
DA4: U10.64(Column_I/O)
DA5: U10.60(Column_I/O)
DA6: U10.59(Column_I/O)
DA7: U10.58(Column_I/O)
DA8: U10.55(Dedicated_Clock)
DA9: U10.54(Dedicated_Clock)
DA10: U10.53(Dedicated_Clock)
DA11: U10.52(Dedicated_Clock)
DA12: U10.51(Column_I/O)
DA13: U10.50(Column_I/O)
DA14: U10.49(Column_I/O)
DA15: U10.46(Column_I/O_VREFB3N0)
DAC1: U10.101(Row_I/O)
DAC2: U10.103(Row_I/O)
DAC3: U10.104(Row_I/O)
DAC4: U10.105(Row_I/O_VREFB6N0)
DAC5: U10.106(Row_I/O)
DAC6: U10.110(Column_I/O)
DAC7: U10.111(Column_I/O)
DAC8: U10.112(Column_I/O)
DAC9: U10.113(Column_I/O)
DAC10: U10.114(Column_I/O)
DAC11: U10.115(Column_I/O)
DAC12: U10.119(Column_I/O_VREFB7N0)
DAC13: U10.120(Column_I/O)
DAC14: U10.121(Column_I/O)
DAC_CLK: U10.125(Column_I/O)
DAC_DIV0: U10.85(Row_I/O)
DAC_DIV1: U10.86(Row_I/O)
DAC_DRV_A0: U10.76(Row_I/O)
DAC_DRV_A1: U10.77(Row_I/O)
DAC_HP1: U10.99(Row_I/O)
DAC_HP2: U10.98(Row_I/O)
DAC_PD: U10.100(Row_I/O)
DAC_X4: U10.87(Row_I/O)
DCDC_SYNC: U10.133(Column_I/O)
DITH: U10.71(Column_I/O)
FPGA_BUS_D0: U10.31(Row_I/O_VREFB2N0)
FPGA_BUS_D1: U10.30(Row_I/O)
FPGA_BUS_D2: U10.28(Row_I/O)
FPGA_BUS_D3: U10.144(Column_I/O)
FPGA_BUS_D4: U10.143(Column_I/O)
FPGA_BUS_D5: U10.142(Column_I/O)
FPGA_BUS_D6: U10.141(Column_I/O)
FPGA_BUS_D7: U10.137(Column_I/O)
FPGA_CLK: U10.33(Row_I/O)
FPGA_SYNC: U10.32(Row_I/O)
OFA: U10.44(Column_I/O)
PGA: U10.42(Column_I/O)
PREAMP: U10.69(Column_I/O)
RAND: U10.43(Column_I/O)
SHDN: U10.72(Column_I/O)
TCXO_CLK: U10.126(Dedicated_Clock)
NetJTAG_FPGA_1: JTAG_FPGA.1 U10.16(JTAG)
NetJTAG_FPGA_3: JTAG_FPGA.3 U10.20(JTAG)
NetJTAG_FPGA_5: JTAG_FPGA.5 R31.1 U10.18(JTAG)
NetJTAG_FPGA_9: JTAG_FPGA.9 R32.1 U10.15(JTAG)
NetR24_2: R24.2 U10.92(CONF_DONE)
NetR30_1: R30.1 U10.9(nSTATUS)
NetR47_1: R47.1 U10.14(nCONFIG)
NetR48_1: R48.1 U10.21(nCE)
NetU9_1: U9.1(nCE) U10.8(Row_I/O)
NetU9_2: U9.2(SO) U10.13(Row_I/O)
NetU9_5: U9.5(SI) U10.6(Row_I/O)
NetU9_6: U9.6(SCK) U10.12(UDCLK)

Not connected (* = marked no-connect by the designer): JTAG_FPGA 6* 7* 8*; U10 7(Row_I/O_VREFB1N0) 10(Row_I/O) 11(Row_I/O) 23(Dedicated_Clock) 24(Dedicated_Clock) 25(Dedicated_Clock) 39(Column_I/O) 80(Row_I/O_VREFB5N0) 83(Row_I/O) 91(Dedicated_Clock) 127(Dedicated_Clock) 128(Dedicated_Clock) 129(Dedicated_Clock)

### Notes on the sheet
- Title
- Size:
- Date:
- A3
- Number:
- Time:
- Revision:
- Sheet
- of
- File:

### Library data of the parts
C61 C62 C70 C72-C74 C76 C79 C82 C84 C86-C88 C91 C94 C95 C98 C99 = CAP_0805: Value: 100n
JTAG_FPGA = IDC10: 2*5 Pin
R24 R30-R32 R47 R48 = RES_0805: Value: 10k
U9 = 25P80: Value: 25P80
U10 = EP4CE22E22C8N: Value: EP4CE22E22C8N

## Sheet POWER.SchDoc: POWER
size A4; DocumentNumber: 10; Revision: 2.0; SheetNumber: 10; SheetTotal: 18
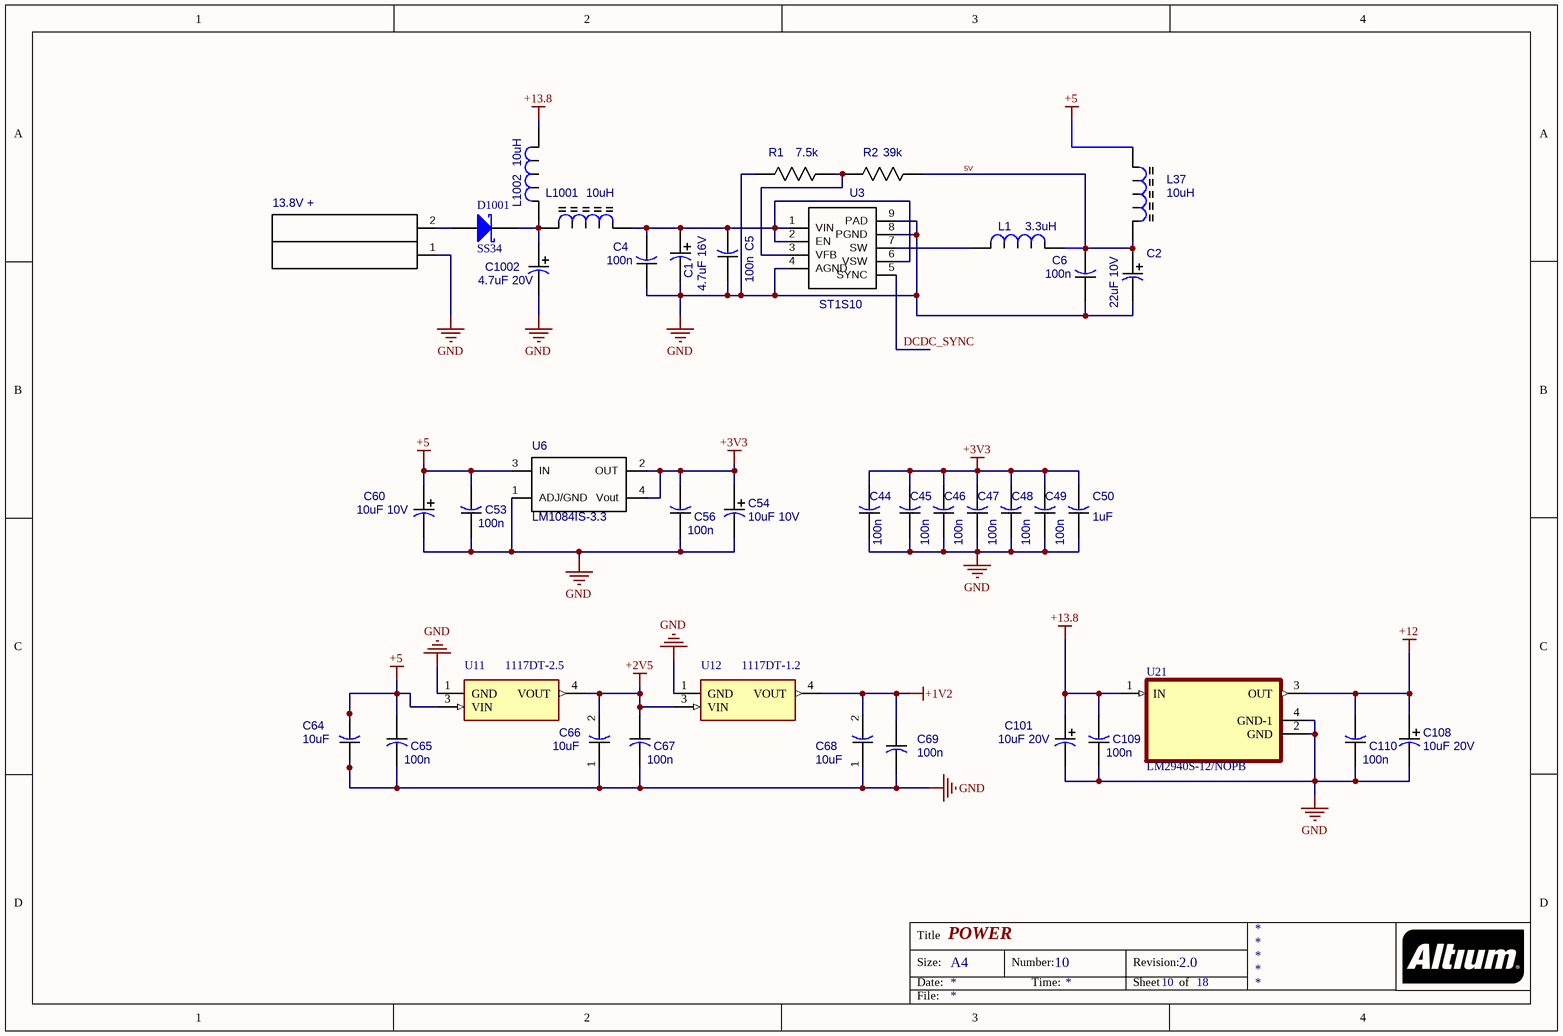
[diagram p5: POWER.SchDoc]

### Parts
13.8V_+  JX2  [JX2]  (value not drawn)
C1  4.7uF 16V  [TANTAL_B]
C2  22uF 10V  [CAPAE_4.3x4.3h5.4]
C4  100n  [CAP_0805]
C5  100n  [CAP_0805]
C6  100n  [CAP_0805]
C44  100n  [CAP_0805]
C45  100n  [CAP_0805]
C46  100n  [CAP_0805]
C47  100n  [CAP_0805]
C48  100n  [CAP_0805]
C49  100n  [CAP_0805]
C50  value 1uF  [CAP_0805]  (hidden comment: 10uF)
C53  100n  [CAP_0805]
C54  10uF 10V  [CAPAE_4.3x4.3h5.4]
C56  100n  [CAP_0805]
C60  10uF 10V  [CAPAE_4.3x4.3h5.4]
C64  10uF  [CAP_0805]
C65  100n  [CAP_0805]
C66  10uF  [CAP_0805]
C67  100n  [CAP_0805]
C68  10uF  [CAP_0805]
C69  100n  [CAP_0805]
C101  10uF 20V  [CAPAE_4.3x4.3h5.4]
C108  10uF 20V  [CAPAE_4.3x4.3h5.4]
C109  100n  [CAP_0805]
C110  100n  [CAP_0805]
C1002  value 4.7uF 20V  [CAPAE_4.3x4.3h5.4]  (hidden comment: 10uF 10V)
D1001  SS34  [SMB]
L1  3.3uH  [IND_1812]
L37  10uH  [IND_7x7]
L1001  10uH  [IND_7x7]
L1002  10uH  [IND_1812]
R1  7.5k  [RES_0805]
R2  39k  [RES_0805]
U3  ST1S10  [ST1S10]
U6  LM1084IS-3.3  [LM1085-3.3]
U11  1117DT-2.5  [TO228P991X238-3N]
U12  1117DT-1.2  [TO228P991X238-3N]
U21  LM2940S-12/NOPB  [TO254P1524X483-4N]

### Nets
+1V2: C68.2 C69.1 U12.4(VOUT)
+2V5: C66.2 C67.1 U11.4(VOUT) U12.3(VIN)
+3V3: C44.2 C45.2 C46.2 C47.2 C48.2 C49.2 C50.2 C54.1(PLUS) C56.2 U6.2(OUT) U6.4(Vout)
+5: C53.2 C60.1(PLUS) C64.2 C65.1 L37.1(A) U6.3(IN) U11.3(VIN)
+12: C108.1(PLUS) C110.2 U21.3(OUT)
+13.8: C101.1(PLUS) C109.2 L1002.2 U21.1(IN)
GND: 13.8V_+.1 C1.2(MINUS) C2.2(MINUS) C4.1 C5.1 C6.1 C44.1 C45.1 C46.1 C47.1 C48.1 C49.1 C50.1 C53.1 C54.2(MINUS) C56.1 C60.2(MINUS) C64.1 C65.2 C66.1 C67.2 C68.1 C69.2 C101.2(MINUS) C108.2(MINUS) C109.1 C110.1 C1002.2(MINUS) R1.1 U3.4(AGND) U3.8(PGND) U3.9(PAD) U6.1(ADJ/GND) U11.1(GND) U12.1(GND) U21.2(GND) U21.4(GND-1)
5V: C2.1(PLUS) C6.2 L1.2 L37.2(B) R2.2
DCDC_SYNC: U3.5(SYNC)
Net13.8V_+_2: 13.8V_+.2 D1001.1(A)
NetC1_1: C1.1(PLUS) C4.2 C5.2 L1001.2(B) U3.1(VIN) U3.2(EN) U3.6(VSW)
NetC1002_1: C1002.1(PLUS) D1001.2(K) L1001.1(A) L1002.1
NetL1_1: L1.1 U3.7(SW)
NetR1_2: R1.2 R2.1 U3.3(VFB)

### Notes on the sheet
- Title
- Size:
- Date:
- A4
- Number:
- Time:
- Revision:
- Sheet
- of
- File:

### Library data of the parts
C1 = CAPAE_6.6x6.6h5.4: Value: 4.7uF 16V
C2 C54 C60 C101 C108 C1002 = CAPAE_4.3x4.3h5.4
  C2: Value: 22uF 10V
  C54 C60: Value: 10uF 10V
  C101 C108: Value: 10uF 20V
C4-C6 C44-C50 C53 C56 C64-C69 C109 C110 = CAP_0805
  C4-C6 C44-C49 C53 C56 C65 C67 C69 C109 C110: Value: 100n
  C64 C66 C68: Value: 10uF
D1001 = D Schottky: Schottky Diode; Published: 8-Jun-2000; LatestRevisionDate: 17-Jul-2002; LatestRevisionNote: Re-released for DXP Platform.; PackageReference: SMB; Publisher: Altium Limited; PackageDescription: DO-214-AA/SMB; 2 C-Bend Leads; Body 5.3 x 3.6 mm, inc. leads (LxW); Code_JEDEC: DO-214-AA
L1 L1002 = IND_1812
  L1: Value: 3.3uH
  L1002: Value: 10uH
L37 L1001 = IND_FERRITE_CORE: Inductor; Value: 10uH
R1 R2 = RES_0805
  R1: Value: 7.5k
  R2: Value: 39k
U6 = LM1085-3.3
U11 = LM1117DT-ADJ: as U18 on sheet ADC; Datasheet Link: http://www.ti.com/lit/ds/symlink/lm1117-n.pdf; Height: 2.38mm; Manufacturer_Part_Number: LM1117DT-ADJ; Mouser Part Number: 926-LM1117DT-ADJ; Mouser Price/Stock: https://www.mouser.com/Search/Refine.aspx?Keyword=926-LM1117DT-ADJ
U12 = LM1117DT-ADJ: LD1117DT-1.2 DPAK; Manufacturer_Name: Texas Instruments; Datasheet Link: http://www.ti.com/lit/ds/symlink/lm1117-n.pdf; Height: 2.38mm; Manufacturer_Part_Number: LM1117DT-ADJ; Mouser Part Number: 926-LM1117DT-ADJ; Mouser Price/Stock: https://www.mouser.com/Search/Refine.aspx?Keyword=926-LM1117DT-ADJ
U21 = LM2940S-12/NOPB: 1-A, 26-V, high-PSRR, low-dropout voltage regulator; MF: Texas Instruments; Price: None; Package: TO-263-3 Texas Instruments; Check_prices: https://www.snapeda.com/parts/LM2940S-12/NOPB/Texas+Instruments/view-part/?ref=eda; Availability: In Stock; MP: LM2940S-12/NOPB; Value: *; SnapEDA_Link: https://www.snapeda.com/parts/LM2940S-12/NOPB/Texas+Instruments/view-part/?ref=snap; Purchase-URL: https://pricing.snapeda.com/search/part/LM2940S-12/NOPB/?ref=eda
U3 = ST1S10: Value: ST1S10

## Sheet STM32.SchDoc: STM32
size A3; DocumentNumber: 11; Revision: 2.0; SheetNumber: 11; SheetTotal: 18
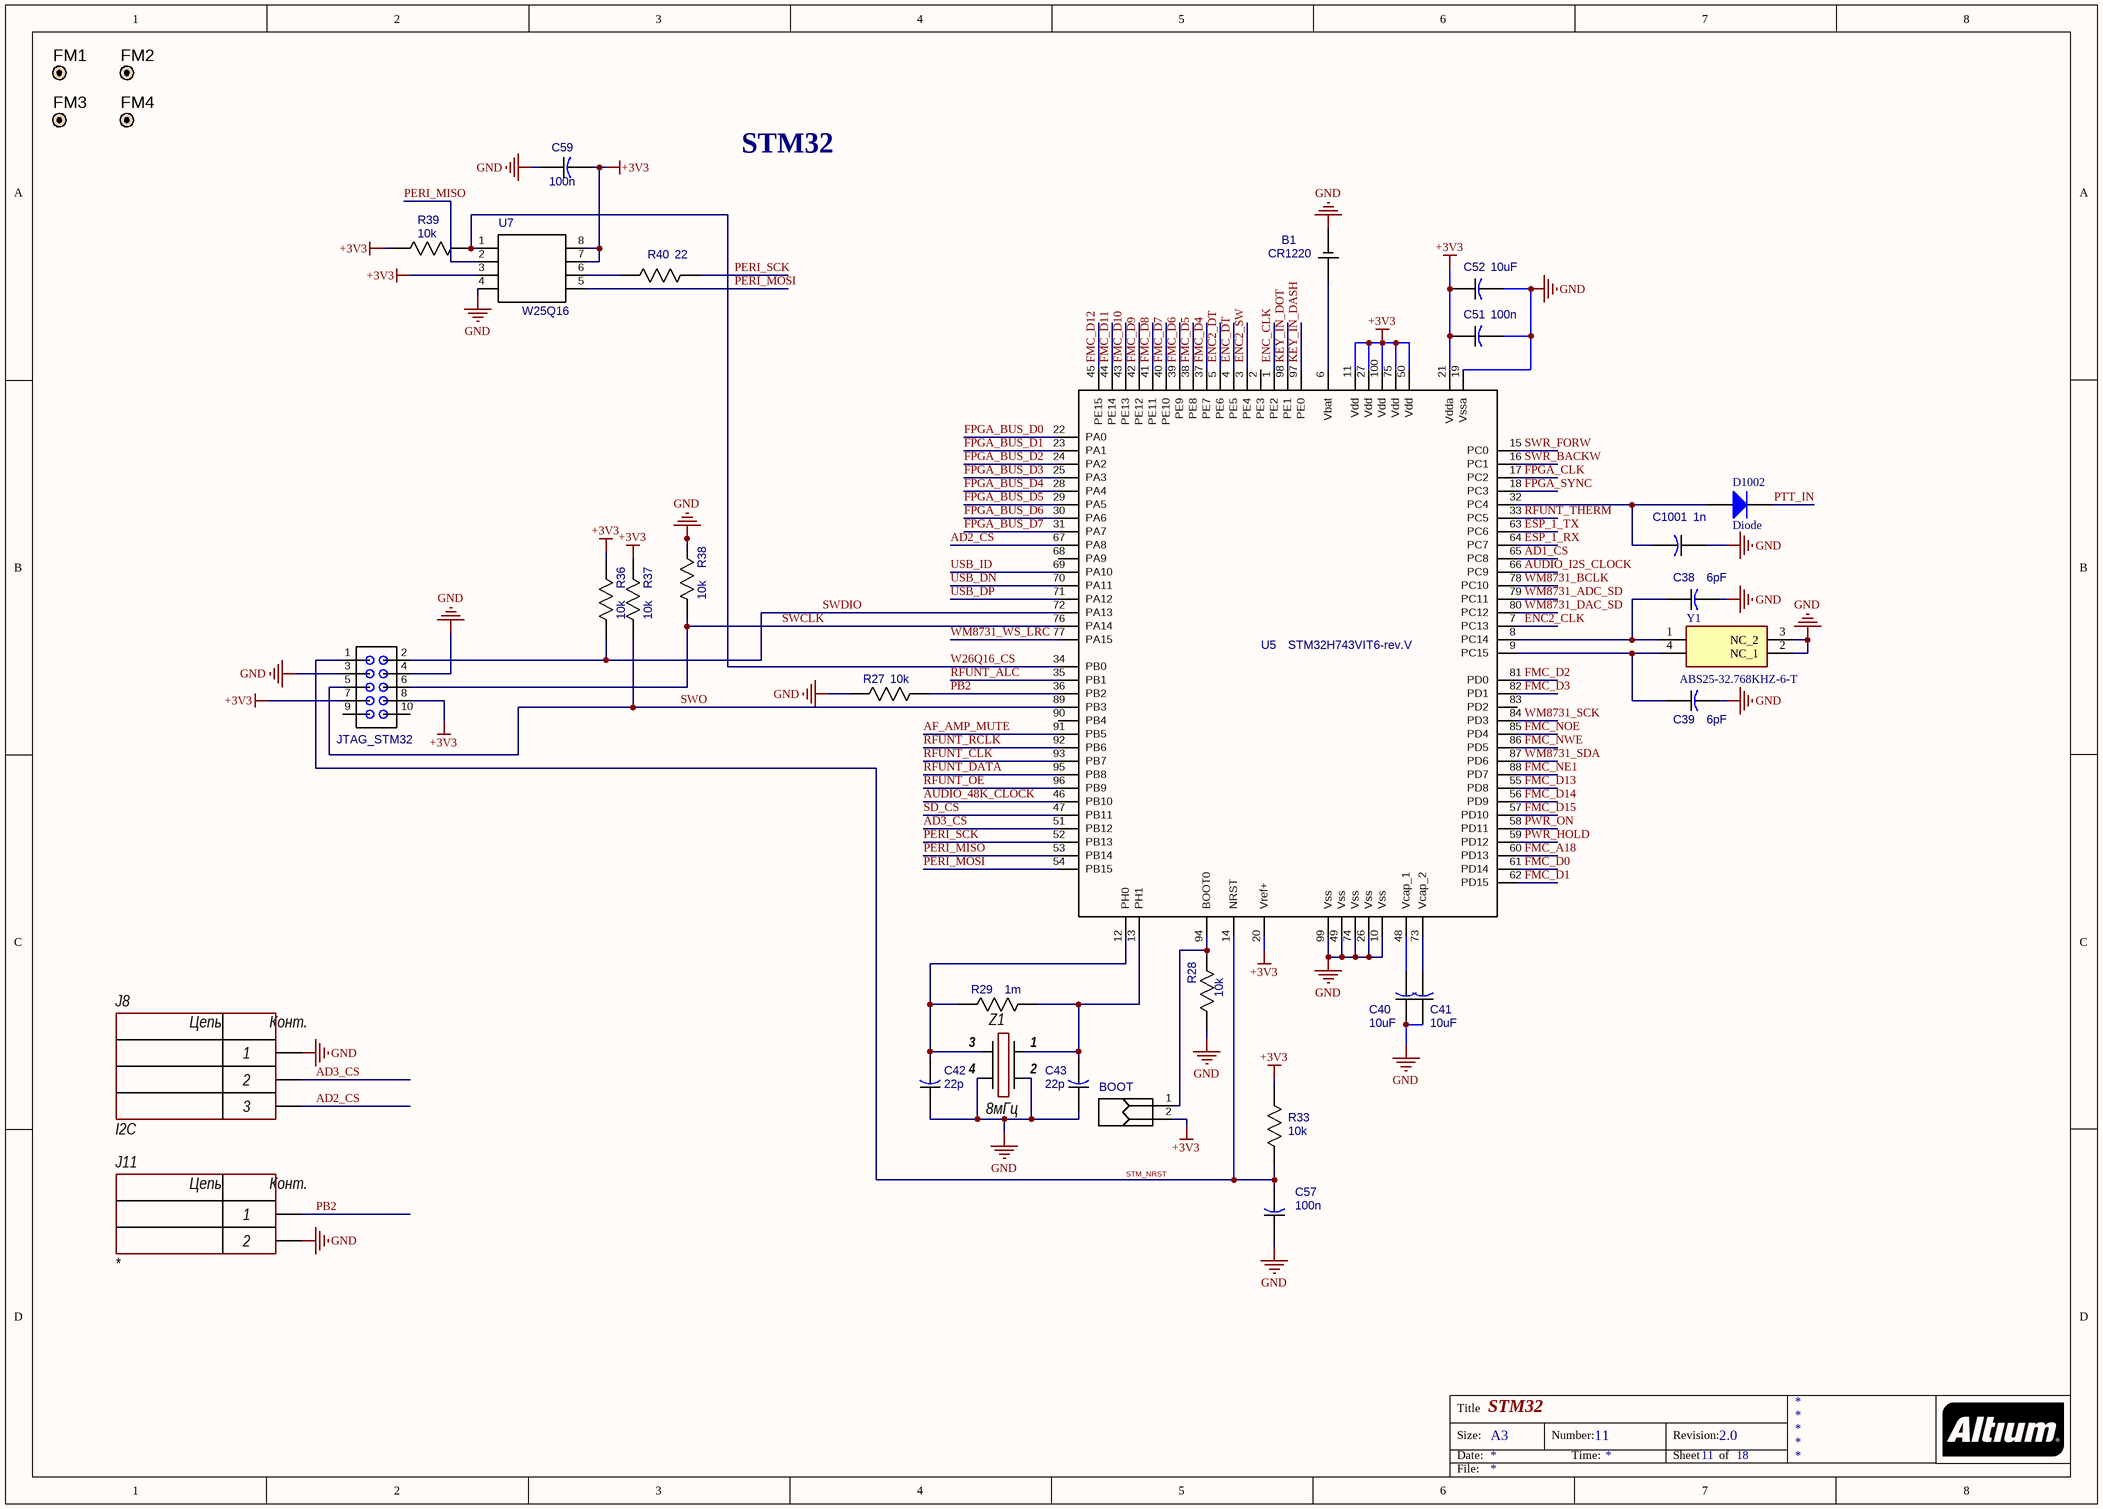
[diagram p6: STM32.SchDoc]

### Parts
B1  value CR1220  [CR1220]  (hidden comment: CR1220 +)
BOOT  (no value)  [51022-0200]
C38  6pF  [CAP_0805]
C39  6pF  [CAP_0805]
C40  10uF  [CAP_0805]
C41  10uF  [CAP_0805]
C42  22p  [CH0805C]
C43  22p  [CH0805C]
C51  100n  [CAP_0805]
C52  10uF  [CAP_0805]
C57  100n  [CAP_0805]
C59  100n  [CAP_0805]
C1001  1n  [CAP_0805]
D1002  Diode  [C1206]
FM1  FM1  [FM]  (value not drawn)
FM2  FM1  [FM]  (value not drawn)
FM3  FM1  [FM]  (value not drawn)
FM4  FM1  [FM]  (value not drawn)
J8  I2C  [CON: CWF-3]
J11  *  [CON: CWF-2]
JTAG_STM32  (no value)  [IDC10]
R27  10k  [RES_0805]
R28  10k  [RES_0805]
R29  1m  [RES_0805]
R33  10k  [RES_0805]
R36  10k  [RES_0805]
R37  10k  [RES_0805]
R38  10k  [RES_0805]
R39  10k  [RES_0805]
R40  22  [RES_0805]
U5  STM32H743VIT6-rev.V  [STM32H743VIT6]
U7  W25Q16  [SOIC-8-1]
Y1  ABS25-32.768KHZ-6-T  [ABS25]
Z1  8мГц  [OSC: 3225]

### Nets
+3V3: BOOT.2 C51.1 C52.1 C59.2 JTAG_STM32.7 JTAG_STM32.8 R33.2 R36.1 R37.1 R39.1 U5.11(Vdd) U5.20(Vref+) U5.21(Vdda) U5.27(Vdd) U5.50(Vdd) U5.75(Vdd) U5.100(Vdd) U7.3(WP) U7.7(HOLD) U7.8(VCC)
GND: B1.2(NEG) C38.2 C39.2 C40.1 C41.1 C42.1 C43.1 C51.2 C52.2 C57.1 C59.1 C1001.1 J8.1 J11.2 JTAG_STM32.3 JTAG_STM32.4 R27.1 R28.1 R38.1 U5.10(Vss) U5.19(Vssa) U5.26(Vss) U5.49(Vss) U5.74(Vss) U5.99(Vss) U7.4(GND) Y1.2(NC_1) Y1.3(NC_2) Z1.2 Z1.4
AD1_CS: U5.65(PC8)
AD2_CS: J8.3 U5.67(PA8)
AD3_CS: J8.2 U5.51(PB12)
AF_AMP_MUTE: U5.91(PB5)
AUDIO_48K_CLOCK: U5.46(PB10)
AUDIO_I2S_CLOCK: U5.66(PC9)
ENC2_CLK: U5.7(PC13)
ENC2_DT: U5.5(PE6)
ENC2_SW: U5.3(PE4)
ENC_CLK: U5.1(PE2)
ENC_DT: U5.4(PE5)
ESP_1_RX: U5.64(PC7)
ESP_1_TX: U5.63(PC6)
FMC_A18: U5.60(PD13)
FMC_D0: U5.61(PD14)
FMC_D1: U5.62(PD15)
FMC_D2: U5.81(PD0)
FMC_D3: U5.82(PD1)
FMC_D4: U5.37(PE7)
FMC_D5: U5.38(PE8)
FMC_D6: U5.39(PE9)
FMC_D7: U5.40(PE10)
FMC_D8: U5.41(PE11)
FMC_D9: U5.42(PE12)
FMC_D10: U5.43(PE13)
FMC_D11: U5.44(PE14)
FMC_D12: U5.45(PE15)
FMC_D13: U5.55(PD8)
FMC_D14: U5.56(PD9)
FMC_D15: U5.57(PD10)
FMC_NE1: U5.88(PD7)
FMC_NOE: U5.85(PD4)
FMC_NWE: U5.86(PD5)
FPGA_BUS_D0: U5.22(PA0)
FPGA_BUS_D1: U5.23(PA1)
FPGA_BUS_D2: U5.24(PA2)
FPGA_BUS_D3: U5.25(PA3)
FPGA_BUS_D4: U5.28(PA4)
FPGA_BUS_D5: U5.29(PA5)
FPGA_BUS_D6: U5.30(PA6)
FPGA_BUS_D7: U5.31(PA7)
FPGA_CLK: U5.17(PC2)
FPGA_SYNC: U5.18(PC3)
KEY_IN_DASH: U5.97(PE0)
KEY_IN_DOT: U5.98(PE1)
PB2: J11.1 R27.2 U5.36(PB2)
PERI_MISO: U5.53(PB14) U7.2(SO)
PERI_MOSI: U5.54(PB15) U7.5(SI)
PERI_SCK: R40.2 U5.52(PB13)
PTT_IN: D1002.2(K)
PWR_HOLD: U5.59(PD12)
PWR_ON: U5.58(PD11)
RFUNT_ALC: U5.35(PB1)
RFUNT_CLK: U5.93(PB7)
RFUNT_DATA: U5.95(PB8)
RFUNT_OE: U5.96(PB9)
RFUNT_RCLK: U5.92(PB6)
RFUNT_THERM: U5.33(PC5)
SD_CS: U5.47(PB11)
STM_NRST: C57.2 JTAG_STM32.1 R33.1 U5.14(NRST)
SWCLK: JTAG_STM32.6 R38.2 U5.76(PA14)
SWDIO: JTAG_STM32.2 R36.2 U5.72(PA13)
SWO: JTAG_STM32.5 R37.2 U5.89(PB3)
SWR_BACKW: U5.16(PC1)
SWR_FORW: U5.15(PC0)
USB_DN: U5.70(PA11)
USB_DP: U5.71(PA12)
USB_ID: U5.69(PA10)
W26Q16_CS: R39.2 U5.34(PB0) U7.1(CS)
WM8731_ADC_SD: U5.79(PC11)
WM8731_BCLK: U5.78(PC10)
WM8731_DAC_SD: U5.80(PC12)
WM8731_SCK: U5.84(PD3)
WM8731_SDA: U5.87(PD6)
WM8731_WS_LRC: U5.77(PA15)
NetB1_1: B1.1(POS) U5.6(Vbat)
NetBOOT_1: BOOT.1 R28.2 U5.94(BOOT0)
NetC38_1: C38.1 U5.8(PC14) Y1.1
NetC39_1: C39.1 U5.9(PC15) Y1.4
NetC40_2: C40.2 U5.48(Vcap_1)
NetC41_2: C41.2 U5.73(Vcap_2)
NetC42_2: C42.2 R29.1 U5.12(PH0) Z1.3
NetC43_2: C43.2 R29.2 U5.13(PH1) Z1.1
NetC1001_2: C1001.2 D1002.1(A) U5.32(PC4)
NetR40_1: R40.1 U7.6(CLK)

Not connected (* = marked no-connect by the designer): JTAG_STM32 9 10; U5 2(PE3) 68(PA9) 83(PD2) 90(PB4)

### Notes on the sheet
- STM32
- Title
- Size:
- Date:
- A3
- Number:
- Time:
- Revision:
- Sheet
- of
- File:
- (in symbol 2-Connector) Цепь; Конт.
- (in symbol 3-Connector) Цепь; Конт.

### Library data of the parts
B1 = BR1632A/FA
BOOT = 51022-0200: 2 Pin
C38-C43 C51 C52 C57 C59 C1001 = CAP_0805
  C40 C41 C52: Value: 10uF
  C42 C43: Value: 22p
  C51 C57 C59: Value: 100n
  C1001: Value: 1n
D1002 = Diode: Default Diode; Published: 8-Jun-2000; LatestRevisionDate: 17-Jul-2002; LatestRevisionNote: Re-released for DXP Platform.; PackageVersion: Sep-1996; PackageReference: SMC; Publisher: Altium Limited; PackageDescription: DO-214-AB/SMC; 2 C-Bend Leads; Body 7.9 x 5.9 mm, inc. leads (LxW); Code_JEDEC: DO-214-AB
FM1-FM4 = FM
J8 = 3-Connector: Model: *; Manufacturer: *; HelpURL: *; ComponentKind: *
J11 = 2-Connector: Model: *; Manufacturer: *; HelpURL: *; ComponentKind: *
JTAG_STM32 = IDC10: 2*5 Pin
R27-R29 R33 R36-R40 = RES_0805
  R27 R28 R33 R36-R39: Value: 10k
  R29: Value: 1m
  R40: Value: 22
U5 = STM32H743VIT6: Value: STM32H743VIT6-rev.V
Y1 = ABS25-32.768KHZ-6-T: Crystal or Oscillator; Manufacturer_Name: ABRACON; Datasheet Link: http://www.abracon.com/Resonators/abs25.pdf; Manufacturer_Part_Number: ABS25-32.768KHZ-6-T; Mouser Part Number: 815-ABS25-32.768K6-T; Mouser Price/Stock: https://www.mouser.co.uk/ProductDetail/ABRACON/ABS25-32768KHZ-6-T?qs=wl%2FhatdkTudHMJeSjMoOzg%3D%3D; RS Part Number: 1712795P; RS Price/Stock: http://uk.rs-online.com/web/p/products/1712795P
Z1 = Generator: Manufacturer: *; Model: *; HelpURL: *; ComponentKind: *; Value: *
U7 = W25Q16: Value: W25Q16

## Sheet CLOCK_GENERATOR.SchDoc: CLOCK_GENERATOR
size A4; DocumentNumber: 6; Revision: 2.0; SheetNumber: 6; SheetTotal: 18
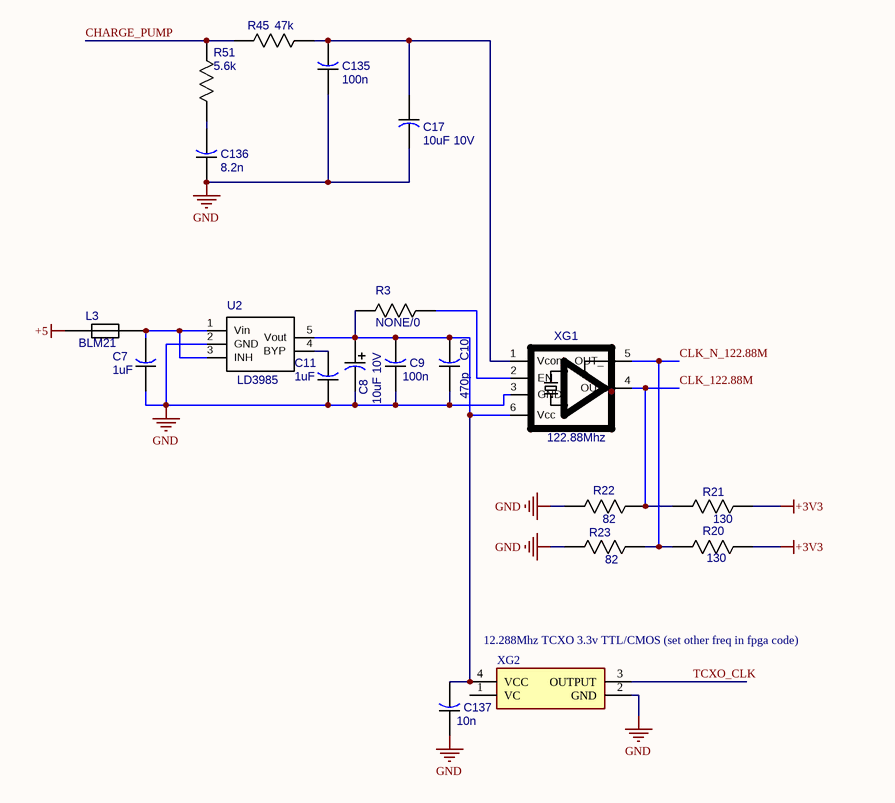
[diagram p7: CLOCK_GENERATOR.SchDoc]

### Parts
C7  1uF  [CAP_0805]
C8  10uF 10V  [CAPAE_4.3x4.3h5.4]
C9  100n  [CAP_0805]
C10  470p  [CAP_0805]
C11  1uF  [CAP_0805]
C17  10uF 10V  [CAP_0805]
C135  100n  [CAP_0805]
C136  8.2n  [CAP_0805]
C137  10n  [CAP_0805]
L3  BLM21  [CAP_0805]
R3  value NONE/0  [RES_0805]  (hidden comment: 0/NONE)
R20  130  [RES_0805]
R21  130  [RES_0805]
R22  82  [RES_0805]
R23  82  [RES_0805]
R45  47k  [RES_0805]
R51  5.6k  [RES_0805]
U2  LD3985  [LD3985]
XG1  122.88Mhz  [NV7050SA]
XG2  12.288Mhz TCXO 3.3v TTL/CMOS (set other freq in fpga code)  [581L200X2ITT]

### Nets
+3V3: R20.1 R21.1
+5: L3.1
CLK_122.88M: R21.2 R22.1 XG1.4(OUT)
CLK_N_122.88M: R20.2 R23.1 XG1.5(OUT_)
GND: C7.1 C8.2(MINUS) C9.1 C10.1 C11.1 C17.2 C135.1 C136.1 C137.1 R22.2 R23.2 U2.2(GND) XG1.3(GND) XG2.2(GND)
CHARGE_PUMP: R45.1 R51.1
TCXO_CLK: XG2.3(OUTPUT)
NetC7_2: C7.2 L3.2 U2.1(Vin) U2.3(INH)
NetC8_1: C8.1(PLUS) C9.2 C10.2 C137.2 R3.1 U2.5(Vout) XG1.6(Vcc) XG2.4(VCC)
NetC11_2: C11.2 U2.4(BYP)
NetC17_1: C17.1 C135.2 R45.2 XG1.1(Vcont)
NetC136_2: C136.2 R51.2
NetR3_2: R3.2 XG1.2(EN)

Not connected (* = marked no-connect by the designer): XG2 1(VC)

### Notes on the sheet
- Title
- Size:
- Date:
- A4
- Number:
- Time:
- Revision:
- Sheet
- of
- File:

### Library data of the parts
C7 C9-C11 C17 C135-C137 = CAP_0805
  C7 C11: Value: 1uF
  C9: Value: 100n
  C10: Value: 470p
  C137: Value: 10n
C8 = CAPAE_4.3x4.3h5.4: Value: 10uF 10V
L3 = IND_FERRITE_BEAD
R3 = RES_0805: By used crystal
R20-R23 R45 R51 = RES_0805
  R20 R21: Value: 130
  R22 R23: Value: 82
XG1 = NV7050SA: NV7050SA / VG-4513CA-122.8800M-GGCT3; Value: 122.88Mhz
XG2 = 581L200X2ITT: Crystal or Oscillator; Manufacturer_Name: CTS; Datasheet Link: https://componentsearchengine.com/Datasheets/1/581L200X2ITT.pdf; Height: 1.65mm; Manufacturer_Part_Number: 581L200X2ITT; Mouser Part Number: 774-581L200X2ITT; Mouser Price/Stock: https://www.mouser.com/Search/Refine.aspx?Keyword=774-581L200X2ITT
U2 = LD3985: Value: LD3985

## Sheet CONNECTIONS.SchDoc: CONNECTIONS
size A4; DocumentNumber: 7; Revision: 2.0; SheetNumber: 7; SheetTotal: 18
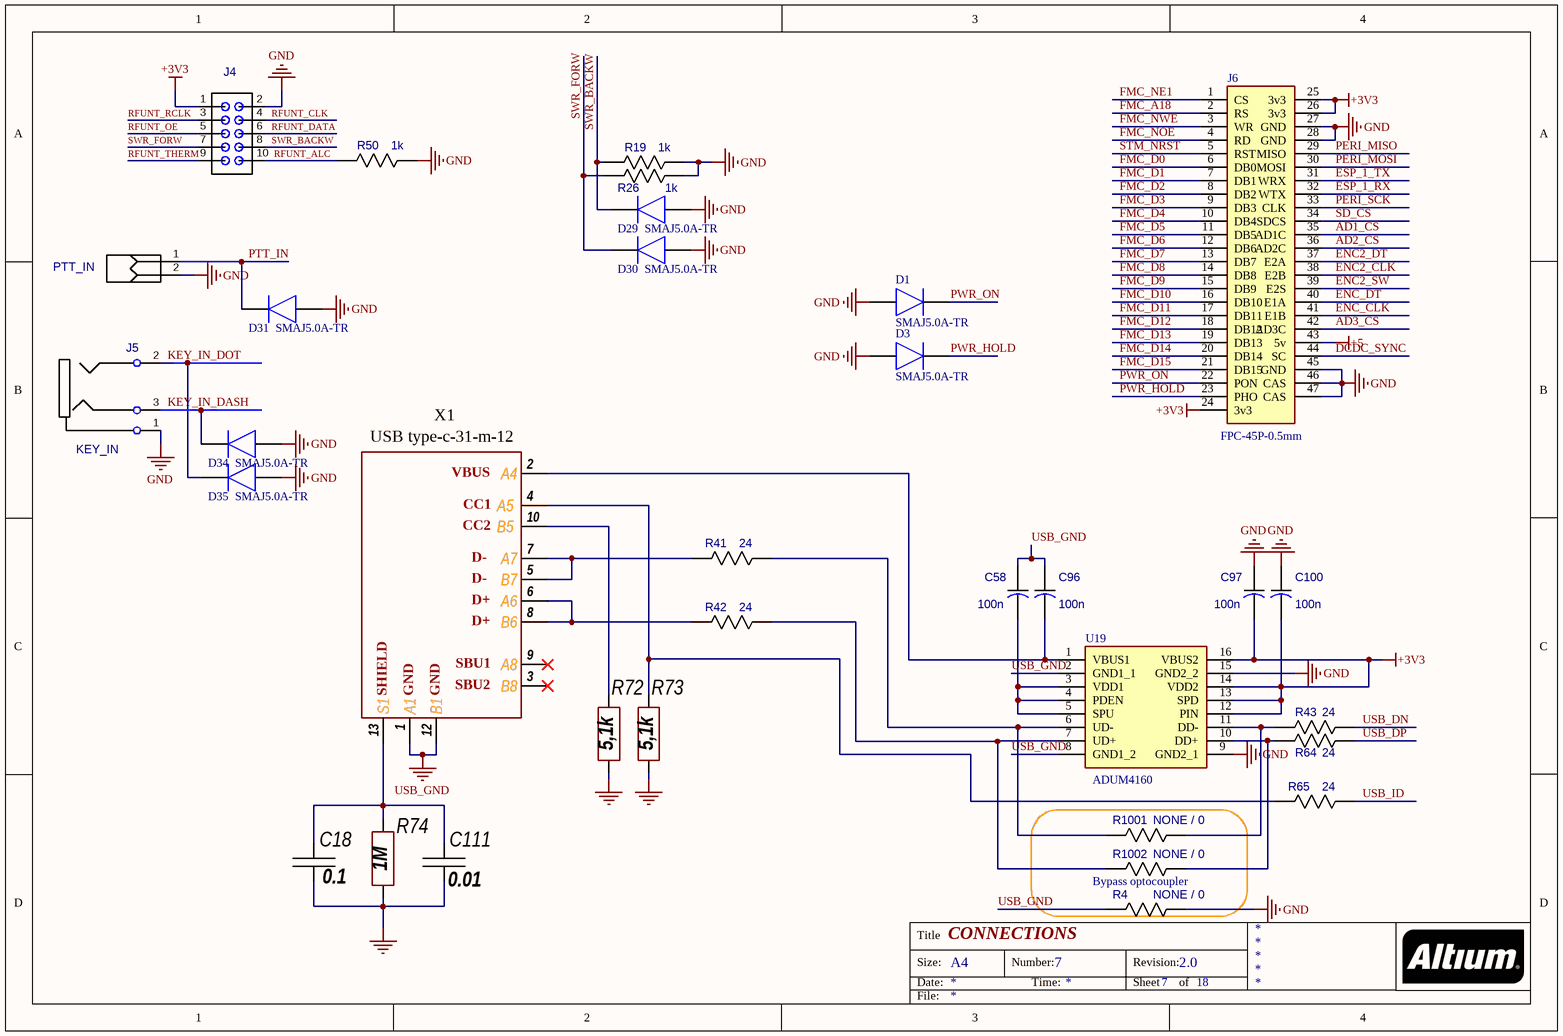
[diagram p8: CONNECTIONS.SchDoc]

### Parts
C18  0.1  [CH0805C]
C58  100n  [CAP_0805]
C96  100n  [CAP_0805]
C97  100n  [CAP_0805]
C100  100n  [CAP_0805]
C111  0.01  [CH0805C]
D1  SMAJ5.0A-TR  [SMBJ36CATR]
D3  SMAJ5.0A-TR  [SMBJ36CATR]
D29  SMAJ5.0A-TR  [SMBJ36CATR]
D30  SMAJ5.0A-TR  [SMBJ36CATR]
D31  SMAJ5.0A-TR  [SMBJ36CATR]
D34  SMAJ5.0A-TR  [SMBJ36CATR]
D35  SMAJ5.0A-TR  [SMBJ36CATR]
J4  (no value)  [IDC10]
J5  value KEY_IN  [SJ1-3525NG]  (hidden comment: SJ1-3525NG)
J6  FPC-45P-0.5mm  [FH12S45S05SH60]
PTT_IN  PTT_IN  [51022-0200]  (value not drawn)
R4  NONE / 0  [RES_0805]
R19  1k  [RES_0805]
R26  1k  [RES_0805]
R41  24  [RES_0805]
R42  24  [RES_0805]
R43  24  [RES_0805]
R50  1k  [RES_0805]
R64  24  [RES_0805]
R65  24  [RES_0805]
R72  5,1k  [CH0805R]
R73  5,1k  [CH0805R]
R74  1M  [CH0805R]
R1001  NONE / 0  [RES_0805]
R1002  NONE / 0  [RES_0805]
U19  ADUM4160  [SOIC127P1032X265-16N]
X1  USB type-c-31-m-12  [TYPE-C-31-M-12_V1]

### Blocks framed on the sheet
Bypass optocoupler: R4 R1001 R1002

### Nets
+3V3: C97.2 C100.2 J4.1 J6.24(3v3) J6.25(3v3) J6.26(3v3) U19.12(PIN) U19.13(SPD) U19.14(VDD2) U19.16(VBUS2)
+5: J6.43(5v)
GND: C18.1 C97.1 C100.1 C111.1 D1.2(A) D3.2(A) D29.2(A) D30.2(A) D31.2(A) D34.2(A) D35.2(A) J4.2 J5.1(sleeve) J6.27(GND) J6.28(GND) J6.45(GND) J6.46(CAS) J6.47(CAS) PTT_IN.2 R4.2 R19.2 R26.2 R50.2 R72.1 R73.1 R74.1 U19.9(GND2_1) U19.15(GND2_2)
USB_GND: C58.1 C96.1 R4.1 U19.2(GND1_1) U19.8(GND1_2) X1.1(A1) X1.12(B1)
AD1_CS: J6.35(AD1C)
AD2_CS: J6.36(AD2C)
AD3_CS: J6.42(AD3C)
DCDC_SYNC: J6.44(SC)
ENC2_CLK: J6.38(E2B)
ENC2_DT: J6.37(E2A)
ENC2_SW: J6.39(E2S)
ENC_CLK: J6.41(E1B)
ENC_DT: J6.40(E1A)
ESP_1_RX: J6.32(WTX)
ESP_1_TX: J6.31(WRX)
FMC_A18: J6.2(RS)
FMC_D0: J6.6(DB0)
FMC_D1: J6.7(DB1)
FMC_D2: J6.8(DB2)
FMC_D3: J6.9(DB3)
FMC_D4: J6.10(DB4)
FMC_D5: J6.11(DB5)
FMC_D6: J6.12(DB6)
FMC_D7: J6.13(DB7)
FMC_D8: J6.14(DB8)
FMC_D9: J6.15(DB9)
FMC_D10: J6.16(DB10)
FMC_D11: J6.17(DB11)
FMC_D12: J6.18(DB12)
FMC_D13: J6.19(DB13)
FMC_D14: J6.20(DB14)
FMC_D15: J6.21(DB15)
FMC_NE1: J6.1(CS)
FMC_NOE: J6.4(RD)
FMC_NWE: J6.3(WR)
KEY_IN_DASH: D34.1(K) J5.3(ring)
KEY_IN_DOT: D35.1(K) J5.2(tip)
PERI_MISO: J6.29(MISO)
PERI_MOSI: J6.30(MOSI)
PERI_SCK: J6.33(CLK)
PTT_IN: D31.1(K) PTT_IN.1
PWR_HOLD: D3.1(K) J6.23(PHO)
PWR_ON: D1.1(K) J6.22(PON)
RFUNT_ALC: J4.10 R50.1
RFUNT_CLK: J4.4
RFUNT_DATA: J4.6
RFUNT_OE: J4.5
RFUNT_RCLK: J4.3
RFUNT_THERM: J4.9
SD_CS: J6.34(SDCS)
STM_NRST: J6.5(RST)
SWR_BACKW: D29.1(K) J4.8 R19.1
SWR_FORW: D30.1(K) J4.7 R26.1
USB_DN: R43.2
USB_DP: R64.2
USB_ID: R65.2
NetC18_2: C18.2 C111.2 R74.2 X1.13(S1)
NetC58_2: C58.2 U19.3(VDD1) U19.4(PDEN) U19.5(SPU)
NetC96_2: C96.2 U19.1(VBUS1) X1.2(A4)
NetR41_1: R41.1 X1.5(B7) X1.7(A7)
NetR41_2: R41.2 R1001.1 U19.6(UD-)
NetR42_1: R42.1 X1.6(A6) X1.8(B6)
NetR42_2: R42.2 R1002.1 U19.7(UD+)
NetR43_1: R43.1 R1001.2 U19.11(DD-)
NetR64_1: R64.1 R1002.2 U19.10(DD+)
NetR65_1: R65.1 R73.2 X1.4(A5)
NetR72_2: R72.2 X1.10(B5)

Not connected (* = marked no-connect by the designer): X1 3(B8)* 9(A8)*

### Notes on the sheet
- Title
- Size:
- Date:
- A4
- Number:
- Time:
- Revision:
- Sheet
- of
- File:
- (in symbol USB-C_2.0) VBUS; CC1; CC2; D-; D+; SBU1; SHIELD; GND; SBU2

### Library data of the parts
C18 C111 = Capacitor: Manufacturer: *; Model: *; HelpURL: *; ComponentKind: *; Value: *
C58 C96 C97 C100 = CAP_0805: Value: 100n
D1 D3 D29-D31 D34 D35 = SMLVT3V3: as D36 on sheet AUDIO CODEC; Datasheet Link: http://www.st.com/web/en/resource/technical/document/datasheet/CD00000923.pdf; Height: 2.65mm; Manufacturer_Part_Number: SMLVT3V3; Mouser Part Number: 511-SMLVT3V3; Mouser Price/Stock: https://www.mouser.com/Search/Refine.aspx?Keyword=511-SMLVT3V3; RS Part Number: 5444821P; RS Price/Stock: http://uk.rs-online.com/web/p/products/5444821P; Allied Price/Stock: http://www.alliedelec.com/stmicroelectronics-smlvt3v3/70013736/
  D31: LCSC Part #: test
J4 = IDC10: 2*5 Pin
J5 = SJ1-3523N
J6 = FH12S-45S-0.5SH_55_: Connector; Manufacturer_Name: Hirose; Manufacturer_Part_Number: FH12S-45S-0.5SH(55); Datasheet Link: https://www.hirose.com/product/en/download_file/key_name/FH12S-45S-0.5SH%2855%29/category/Drawing%20(2D)/doc_file_id/43881/?file_category_id=6&item_id=05860665055&is_series=; Height: 2mm; Mouser Part Number: 798-FH12S-45S-05SH55; Mouser Price/Stock: https://www.mouser.co.uk/ProductDetail/Hirose-Connector/FH12S-45S-05SH55?qs=0N%252BVULUZFj%252BE0LA99Ny0NA%3D%3D; RS Part Number: 1620942; RS Price/Stock: http://uk.rs-online.com/web/p/products/1620942
PTT_IN = 51022-0200
R4 R19 R26 R41-R43 R50 R64 R65 R1001 R1002 = RES_0805
  R19 R26 R50: Value: 1k
R72-R74 = Resistor: Manufacturer: *; Model: *; HelpURL: *; ComponentKind: *; Value: *
U19 = ADUM4160BRWZ: Integrated Circuit; Manufacturer_Name: Analog Devices; Datasheet Link: http://uk.rs-online.com/web/p/products/9129526; Height: 2.65mm; Manufacturer_Part_Number: ADUM4160BRWZ; Mouser Part Number: 584-ADUM4160BRWZ; Mouser Price/Stock: https://www.mouser.co.uk/ProductDetail/Analog-Devices/ADUM4160BRWZ/?qs=WIvQP4zGanj8VHq3sVqu9A%3D%3D; Arrow Part Number: ADUM4160BRWZ; Arrow Price/Stock: https://www.arrow.com/en/products/adum4160brwz/analog-devices
X1 = USB-C_2.0

## Nets that join several sheets
+1V2: FPGA (26 pins), POWER (C68.2 C69.1 U12.4)
+2V5: FPGA (8 pins), POWER (C66.2 C67.1 U11.4 U12.3)
+3V3: AUDIO CODEC (10 pins), FPGA (28 pins), POWER (11 pins), STM32 (20 pins), CLOCK_GENERATOR (R20.1 R21.1), CONNECTIONS (10 pins)
+5: ADC (C123.2 C125.1 U18.3), AUDIO CODEC (C14.1 L9.2), DAC (C80.1 C81.2 U13.3), POWER (7 pins), CLOCK_GENERATOR (L3.1), CONNECTIONS (J6.43)
+12: DAC (5 pins), POWER (C108.1 C110.2 U21.3)
+13.8: ADC (J7.1 R75.2), POWER (C101.1 C109.2 L1002.2 U21.1)
CLK_122.88M: ADC (U16.12), FPGA (U10.89), CLOCK_GENERATOR (R21.2 R22.1 XG1.4)
CLK_N_122.88M: ADC (U16.13), FPGA (U10.88), CLOCK_GENERATOR (R20.2 R23.1 XG1.5)
GND: ADC (40 pins), AUDIO CODEC (39 pins), DAC (52 pins), FPGA (44 pins), POWER (37 pins), STM32 (30 pins), CLOCK_GENERATOR (14 pins), CONNECTIONS (28 pins)
AD1_CS: STM32 (U5.65), CONNECTIONS (J6.35)
AD2_CS: STM32 (J8.3 U5.67), CONNECTIONS (J6.36)
AD3_CS: STM32 (J8.2 U5.51), CONNECTIONS (J6.42)
AF_AMP_MUTE: AUDIO CODEC (R17.2), STM32 (U5.91)
AUDIO_48K_CLOCK: FPGA (U10.136), STM32 (U5.46)
AUDIO_I2S_CLOCK: AUDIO CODEC (U4.25), FPGA (U10.135), STM32 (U5.66)
CHARGE_PUMP: FPGA (U10.132), CLOCK_GENERATOR (R45.1 R51.1)
CLKOUTA: ADC (U16.41), FPGA (U10.90)
DA0: ADC (U16.42), FPGA (U10.68)
DA1: ADC (U16.43), FPGA (U10.67)
DA2: ADC (U16.44), FPGA (U10.66)
DA3: ADC (U16.45), FPGA (U10.65)
DA4: ADC (U16.46), FPGA (U10.64)
DA5: ADC (U16.47), FPGA (U10.60)
DA6: ADC (U16.48), FPGA (U10.59)
DA7: ADC (U16.51), FPGA (U10.58)
DA8: ADC (U16.52), FPGA (U10.55)
DA9: ADC (U16.53), FPGA (U10.54)
DA10: ADC (U16.54), FPGA (U10.53)
DA11: ADC (U16.55), FPGA (U10.52)
DA12: ADC (U16.56), FPGA (U10.51)
DA13: ADC (U16.57), FPGA (U10.50)
DA14: ADC (U16.58), FPGA (U10.49)
DA15: ADC (U16.59), FPGA (U10.46)
DAC1: DAC (U8.16), FPGA (U10.101)
DAC2: DAC (U8.15), FPGA (U10.103)
DAC3: DAC (U8.14), FPGA (U10.104)
DAC4: DAC (U8.13), FPGA (U10.105)
DAC5: DAC (U8.12), FPGA (U10.106)
DAC6: DAC (U8.11), FPGA (U10.110)
DAC7: DAC (U8.10), FPGA (U10.111)
DAC8: DAC (U8.9), FPGA (U10.112)
DAC9: DAC (U8.8), FPGA (U10.113)
DAC10: DAC (U8.7), FPGA (U10.114)
DAC11: DAC (U8.6), FPGA (U10.115)
DAC12: DAC (U8.5), FPGA (U10.119)
DAC13: DAC (U8.4), FPGA (U10.120)
DAC14: DAC (U8.3), FPGA (U10.121)
DAC_CLK: DAC (R53.1), FPGA (U10.125)
DAC_DIV0: DAC (U8.28), FPGA (U10.85)
DAC_DIV1: DAC (U8.27), FPGA (U10.86)
DAC_DRV_A0: DAC (R18.1), FPGA (U10.76)
DAC_DRV_A1: DAC (R52.1), FPGA (U10.77)
DAC_HP1: DAC (U8.17), FPGA (U10.99)
DAC_HP2: DAC (U8.18), FPGA (U10.98)
DAC_PD: DAC (U8.36), FPGA (U10.100)
DAC_X4: DAC (U8.23), FPGA (U10.87)
DCDC_SYNC: FPGA (U10.133), POWER (U3.5), CONNECTIONS (J6.44)
DITH: ADC (U16.20), FPGA (U10.71)
ENC2_CLK: STM32 (U5.7), CONNECTIONS (J6.38)
ENC2_DT: STM32 (U5.5), CONNECTIONS (J6.37)
ENC2_SW: STM32 (U5.3), CONNECTIONS (J6.39)
ENC_CLK: STM32 (U5.1), CONNECTIONS (J6.41)
ENC_DT: STM32 (U5.4), CONNECTIONS (J6.40)
ESP_1_RX: STM32 (U5.64), CONNECTIONS (J6.32)
ESP_1_TX: STM32 (U5.63), CONNECTIONS (J6.31)
FMC_A18: STM32 (U5.60), CONNECTIONS (J6.2)
FMC_D0: STM32 (U5.61), CONNECTIONS (J6.6)
FMC_D1: STM32 (U5.62), CONNECTIONS (J6.7)
FMC_D2: STM32 (U5.81), CONNECTIONS (J6.8)
FMC_D3: STM32 (U5.82), CONNECTIONS (J6.9)
FMC_D4: STM32 (U5.37), CONNECTIONS (J6.10)
FMC_D5: STM32 (U5.38), CONNECTIONS (J6.11)
FMC_D6: STM32 (U5.39), CONNECTIONS (J6.12)
FMC_D7: STM32 (U5.40), CONNECTIONS (J6.13)
FMC_D8: STM32 (U5.41), CONNECTIONS (J6.14)
FMC_D9: STM32 (U5.42), CONNECTIONS (J6.15)
FMC_D10: STM32 (U5.43), CONNECTIONS (J6.16)
FMC_D11: STM32 (U5.44), CONNECTIONS (J6.17)
FMC_D12: STM32 (U5.45), CONNECTIONS (J6.18)
FMC_D13: STM32 (U5.55), CONNECTIONS (J6.19)
FMC_D14: STM32 (U5.56), CONNECTIONS (J6.20)
FMC_D15: STM32 (U5.57), CONNECTIONS (J6.21)
FMC_NE1: STM32 (U5.88), CONNECTIONS (J6.1)
FMC_NOE: STM32 (U5.85), CONNECTIONS (J6.4)
FMC_NWE: STM32 (U5.86), CONNECTIONS (J6.3)
FPGA_BUS_D0: FPGA (U10.31), STM32 (U5.22)
FPGA_BUS_D1: FPGA (U10.30), STM32 (U5.23)
FPGA_BUS_D2: FPGA (U10.28), STM32 (U5.24)
FPGA_BUS_D3: FPGA (U10.144), STM32 (U5.25)
FPGA_BUS_D4: FPGA (U10.143), STM32 (U5.28)
FPGA_BUS_D5: FPGA (U10.142), STM32 (U5.29)
FPGA_BUS_D6: FPGA (U10.141), STM32 (U5.30)
FPGA_BUS_D7: FPGA (U10.137), STM32 (U5.31)
FPGA_CLK: FPGA (U10.33), STM32 (U5.17)
FPGA_SYNC: FPGA (U10.32), STM32 (U5.18)
KEY_IN_DASH: STM32 (U5.97), CONNECTIONS (D34.1 J5.3)
KEY_IN_DOT: STM32 (U5.98), CONNECTIONS (D35.1 J5.2)
OFA: ADC (U16.60), FPGA (U10.44)
PERI_MISO: STM32 (U5.53 U7.2), CONNECTIONS (J6.29)
PERI_MOSI: STM32 (U5.54 U7.5), CONNECTIONS (J6.30)
PERI_SCK: STM32 (R40.2 U5.52), CONNECTIONS (J6.33)
PGA: ADC (U16.64), FPGA (U10.42)
PREAMP: ADC (R66.2), FPGA (U10.69)
PTT_IN: AUDIO CODEC (MIC_IN2.3 R1003.2), STM32 (D1002.2), CONNECTIONS (D31.1 PTT_IN.1)
PWR_HOLD: STM32 (U5.59), CONNECTIONS (D3.1 J6.23)
PWR_ON: STM32 (U5.58), CONNECTIONS (D1.1 J6.22)
RAND: ADC (U16.63), FPGA (U10.43)
RFUNT_ALC: STM32 (U5.35), CONNECTIONS (J4.10 R50.1)
RFUNT_CLK: STM32 (U5.93), CONNECTIONS (J4.4)
RFUNT_DATA: STM32 (U5.95), CONNECTIONS (J4.6)
RFUNT_OE: STM32 (U5.96), CONNECTIONS (J4.5)
RFUNT_RCLK: STM32 (U5.92), CONNECTIONS (J4.3)
RFUNT_THERM: STM32 (U5.33), CONNECTIONS (J4.9)
SD_CS: STM32 (U5.47), CONNECTIONS (J6.34)
SHDN: ADC (U16.19), FPGA (U10.72)
STM_NRST: STM32 (C57.2 JTAG_STM32.1 R33.1 U5.14), CONNECTIONS (J6.5)
SWR_BACKW: STM32 (U5.16), CONNECTIONS (D29.1 J4.8 R19.1)
SWR_FORW: STM32 (U5.15), CONNECTIONS (D30.1 J4.7 R26.1)
TCXO_CLK: FPGA (U10.126), CLOCK_GENERATOR (XG2.3)
USB_DN: STM32 (U5.70), CONNECTIONS (R43.2)
USB_DP: STM32 (U5.71), CONNECTIONS (R64.2)
USB_ID: STM32 (U5.69), CONNECTIONS (R65.2)
WM8731_ADC_SD: AUDIO CODEC (U4.6), STM32 (U5.79)
WM8731_BCLK: AUDIO CODEC (U4.3), STM32 (U5.78)
WM8731_DAC_SD: AUDIO CODEC (U4.4), STM32 (U5.80)
WM8731_SCK: AUDIO CODEC (U4.24), STM32 (U5.84)
WM8731_SDA: AUDIO CODEC (U4.23), STM32 (U5.87)
WM8731_WS_LRC: AUDIO CODEC (U4.5 U4.7), STM32 (U5.77)